# Altium project parallella_schematic.PrjPcb (part 2 of 3)

## Sheet 09-PL BANKS 34 & 35.SchDoc
size 513 x 386 mm
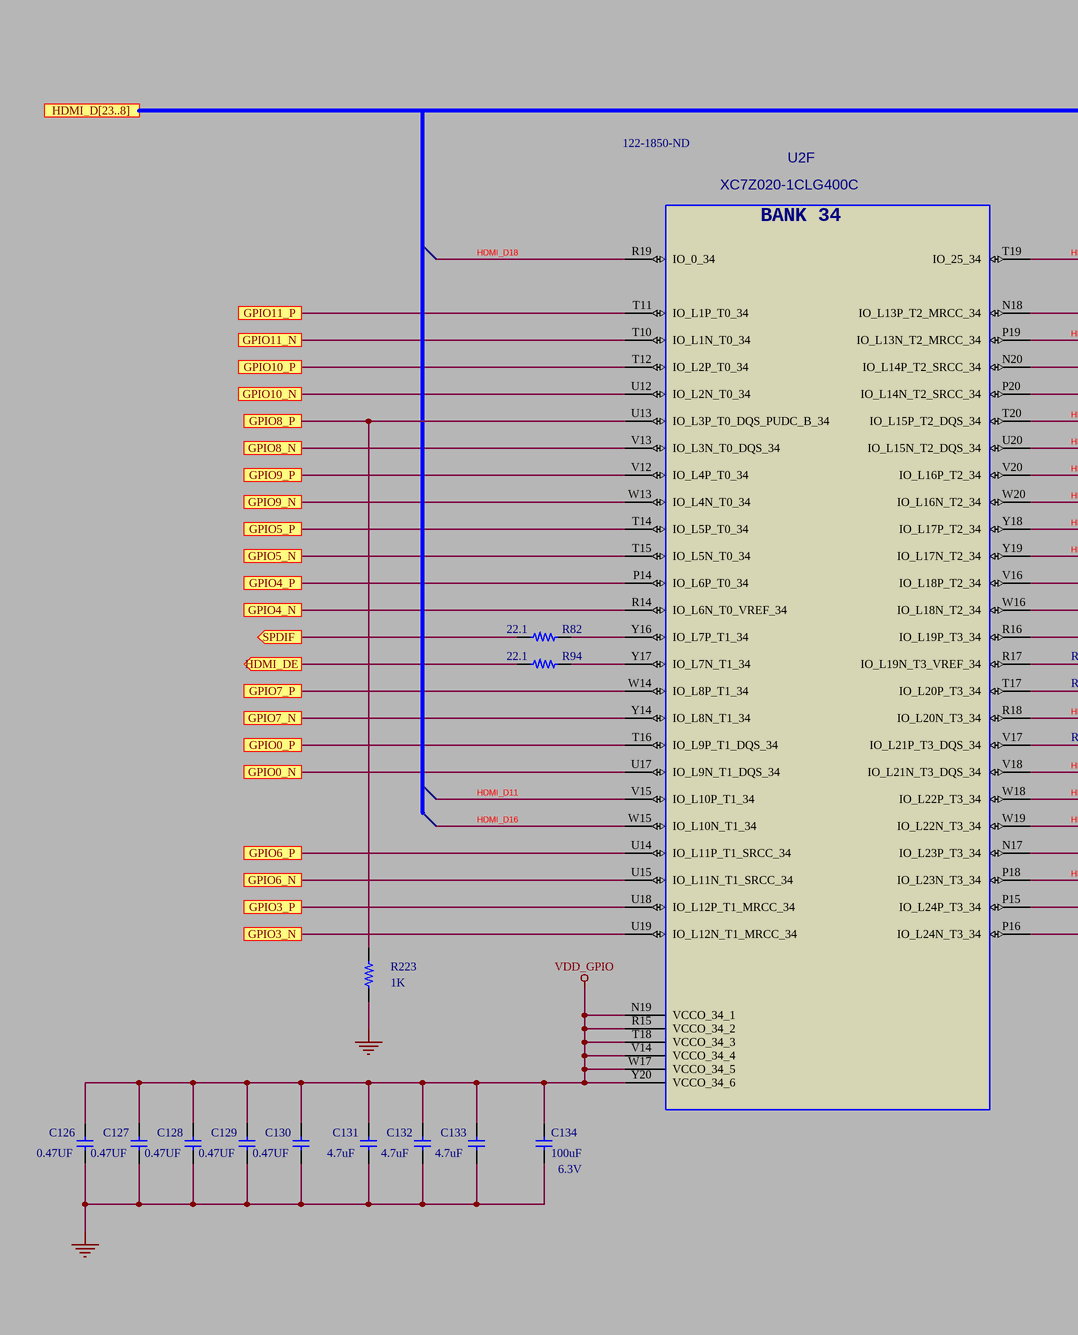
[diagram p11: 09-PL BANKS 34 & 35.SchDoc, left]
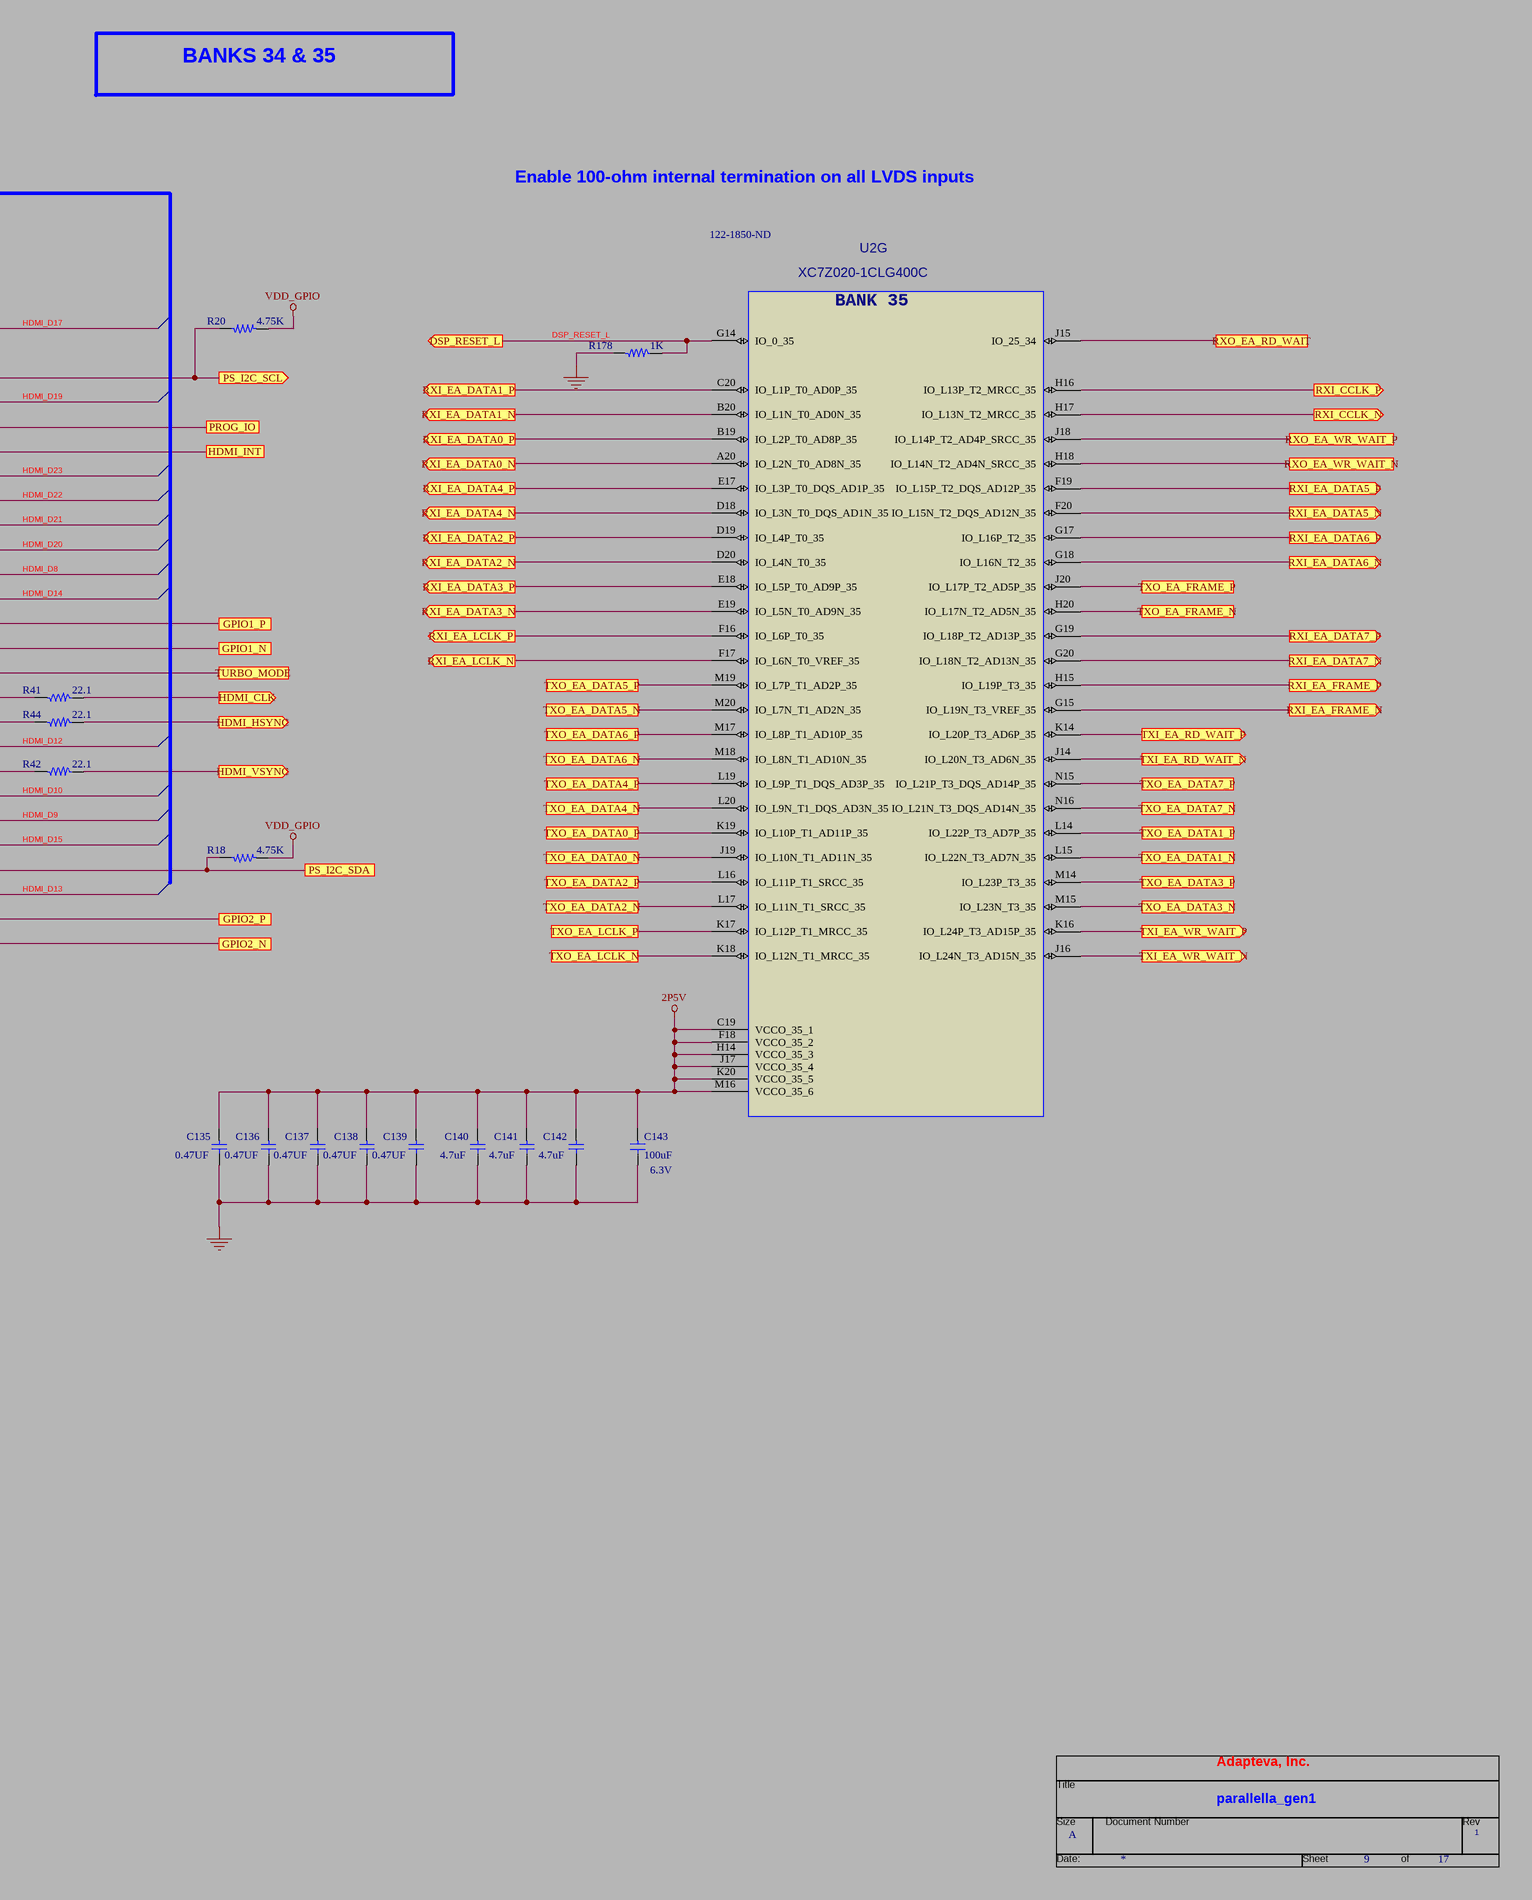
[diagram p12: 09-PL BANKS 34 & 35.SchDoc, right]

### Parts
(Parts that share a designator on the sheet are numbered #1, #2 ... from top to bottom, then left to right.)
*#9  RevCode: 1  Title: parallella_gen1  Page Size: A  Page Number: 9  Page Count: 17  OrgAddr1: Adapteva, Inc.  (hidden comment: TitleBlock0)  (graphical)
C126  0.47UF  [C0402]
C127  0.47UF  [C0402]
C128  0.47UF  [C0402]
C129  0.47UF  [C0402]
C130  0.47UF  [C0402]
C131  4.7uF  [C0402]
C132  4.7uF  [C0402]
C133  4.7uF  [C0402]
C134  100uF  VOLTAGE: 6.3V  [C1210]
C135  0.47UF  [C0402]
C136  0.47UF  [C0402]
C137  0.47UF  [C0402]
C138  0.47UF  [C0402]
C139  0.47UF  [C0402]
C140  4.7uF  [C0402]
C141  4.7uF  [C0402]
C142  4.7uF  [C0402]
C143  100uF  VOLTAGE: 6.3V  [C1210]
R18  4.75K  [R0402]
R20  4.75K  [R0402]
R41  22.1  [R0402]
R42  22.1  [R0402]
R44  22.1  [R0402]
R82  22.1  [R0402]
R94  22.1  [R0402]
R178  1K  [R0402]
R223  1K  [R0402]
U2  Vendor PN: XC7Z020-1CLG400C  Supplier Part Number 1: 122-1850-ND  [CBGA400_17SQ_1P6H_P8MMP]  (hidden comment: 7Z020-CLG400)  (parts F,G of 8)

### Ports
DSP_RESET_L (out), GPIO0_N, GPIO0_P, GPIO1_N, GPIO1_P, GPIO2_N, GPIO2_P, GPIO3_N, GPIO3_P, GPIO4_N, GPIO4_P, GPIO5_N, GPIO5_P, GPIO6_N, GPIO6_P, GPIO7_N, GPIO7_P, GPIO8_N, GPIO8_P, GPIO9_N, GPIO9_P, GPIO10_N, GPIO10_P, GPIO11_N, GPIO11_P, HDMI_CLK (out), HDMI_D[23..8], HDMI_DE (out), HDMI_HSYNC (out), HDMI_INT, HDMI_VSYNC (out), PROG_IO, PS_I2C_SCL (out), PS_I2C_SDA, RXI_CCLK_N (out), RXI_CCLK_P (out), RXI_EA_DATA0_N (out), RXI_EA_DATA0_P (out), RXI_EA_DATA1_N (out), RXI_EA_DATA1_P (out), RXI_EA_DATA2_N (out), RXI_EA_DATA2_P (out), RXI_EA_DATA3_N (out), RXI_EA_DATA3_P (out), RXI_EA_DATA4_N (out), RXI_EA_DATA4_P (out), RXI_EA_DATA5_N (out), RXI_EA_DATA5_P (out), RXI_EA_DATA6_N (out), RXI_EA_DATA6_P (out), RXI_EA_DATA7_N (out), RXI_EA_DATA7_P (out), RXI_EA_FRAME_N (out), RXI_EA_FRAME_P (out), RXI_EA_LCLK_N (out), RXI_EA_LCLK_P (out), RXO_EA_RD_WAIT, RXO_EA_WR_WAIT_N, RXO_EA_WR_WAIT_P, SPDIF (out), TURBO_MODE, TXI_EA_RD_WAIT_N (out), TXI_EA_RD_WAIT_P (out), TXI_EA_WR_WAIT_N (out), TXI_EA_WR_WAIT_P (out), TXO_EA_DATA0_N, TXO_EA_DATA0_P, TXO_EA_DATA1_N, TXO_EA_DATA1_P, TXO_EA_DATA2_N, TXO_EA_DATA2_P, TXO_EA_DATA3_N, TXO_EA_DATA3_P, TXO_EA_DATA4_N, TXO_EA_DATA4_P, TXO_EA_DATA5_N, TXO_EA_DATA5_P, TXO_EA_DATA6_N, TXO_EA_DATA6_P, TXO_EA_DATA7_N, TXO_EA_DATA7_P, TXO_EA_FRAME_N, TXO_EA_FRAME_P, TXO_EA_LCLK_N, TXO_EA_LCLK_P

### Nets
2P5V: C135.1 C136.1 C137.1 C138.1 C139.1 C140.1 C141.1 C142.1 C143.1 U2.C19(VCCO_35_1) U2.F18(VCCO_35_2) U2.H14(VCCO_35_3) U2.J17(VCCO_35_4) U2.K20(VCCO_35_5) U2.M16(VCCO_35_6)
GND: C126.2 C127.2 C128.2 C129.2 C130.2 C131.2 C132.2 C133.2 C134.2 C135.2 C136.2 C137.2 C138.2 C139.2 C140.2 C141.2 C142.2 C143.2 R178.1 R223.1  [project net PHY_DIS_REG10]
VDD_GPIO: C126.1 C127.1 C128.1 C129.1 C130.1 C131.1 C132.1 C133.1 C134.1 R18.1 R20.1 U2.N19(VCCO_34_1) U2.R15(VCCO_34_2) U2.T18(VCCO_34_3) U2.V14(VCCO_34_4) U2.W17(VCCO_34_5) U2.Y20(VCCO_34_6)
DSP_RESET_L: R178.2 U2.G14(IO_0_35) ; port DSP_RESET_L
HDMI_D8: U2.Y18(IO_L17P_T2_34)
HDMI_D9: U2.W18(IO_L22P_T3_34)
HDMI_D10: U2.V18(IO_L21N_T3_DQS_34)
HDMI_D11: U2.V15(IO_L10P_T1_34)
HDMI_D12: U2.R18(IO_L20N_T3_34)
HDMI_D13: U2.P18(IO_L23N_T3_34)
HDMI_D14: U2.Y19(IO_L17N_T2_34)
HDMI_D15: U2.W19(IO_L22N_T3_34)
HDMI_D16: U2.W15(IO_L10N_T1_34)
HDMI_D17: U2.T19(IO_25_34)
HDMI_D18: U2.R19(IO_0_34)
HDMI_D19: U2.P19(IO_L13N_T2_MRCC_34)
HDMI_D20: U2.W20(IO_L16N_T2_34)
HDMI_D21: U2.V20(IO_L16P_T2_34)
HDMI_D22: U2.U20(IO_L15N_T2_DQS_34)
HDMI_D23: U2.T20(IO_L15P_T2_DQS_34)
NetJ11_3: U2.U17(IO_L9N_T1_DQS_34) ; port GPIO0_N
NetJ11_4: U2.W16(IO_L18N_T2_34) ; port GPIO1_N
NetJ11_5: U2.T16(IO_L9P_T1_DQS_34) ; port GPIO0_P
NetJ11_6: U2.V16(IO_L18P_T2_34) ; port GPIO1_P
NetJ11_7: U2.P16(IO_L24N_T3_34) ; port GPIO2_N
NetJ11_8: U2.U19(IO_L12N_T1_MRCC_34) ; port GPIO3_N
NetJ11_9: U2.P15(IO_L24P_T3_34) ; port GPIO2_P
NetJ11_10: U2.U18(IO_L12P_T1_MRCC_34) ; port GPIO3_P
NetJ11_13: U2.R14(IO_L6N_T0_VREF_34) ; port GPIO4_N
NetJ11_14: U2.T15(IO_L5N_T0_34) ; port GPIO5_N
NetJ11_15: U2.P14(IO_L6P_T0_34) ; port GPIO4_P
NetJ11_16: U2.T14(IO_L5P_T0_34) ; port GPIO5_P
NetJ11_17: U2.U15(IO_L11N_T1_SRCC_34) ; port GPIO6_N
NetJ11_18: U2.Y14(IO_L8N_T1_34) ; port GPIO7_N
NetJ11_19: U2.U14(IO_L11P_T1_SRCC_34) ; port GPIO6_P
NetJ11_20: U2.W14(IO_L8P_T1_34) ; port GPIO7_P
NetJ11_23: U2.V13(IO_L3N_T0_DQS_34) ; port GPIO8_N
NetJ11_24: U2.W13(IO_L4N_T0_34) ; port GPIO9_N
NetJ11_25: R223.2 U2.U13(IO_L3P_T0_DQS_PUDC_B_34) ; port GPIO8_P
NetJ11_26: U2.V12(IO_L4P_T0_34) ; port GPIO9_P
NetJ11_27: U2.U12(IO_L2N_T0_34) ; port GPIO10_N
NetJ11_28: U2.T10(IO_L1N_T0_34) ; port GPIO11_N
NetJ11_29: U2.T12(IO_L2P_T0_34) ; port GPIO10_P
NetJ11_30: U2.T11(IO_L1P_T0_34) ; port GPIO11_P
NetJ13_9: U2.N20(IO_L14P_T2_SRCC_34) ; port PROG_IO
NetJ13_25: U2.R16(IO_L19P_T3_34) ; port TURBO_MODE
NetJ13_27: R82.2 ; port SPDIF
NetR18_2: R18.2 U2.N17(IO_L23P_T3_34) ; port PS_I2C_SDA
NetR20_2: R20.2 U2.N18(IO_L13P_T2_MRCC_34) ; port PS_I2C_SCL
NetR22_1: U2.P20(IO_L14N_T2_SRCC_34) ; port HDMI_INT
NetR41_1: R41.1 U2.R17(IO_L19N_T3_VREF_34)
NetR41_2: R41.2 ; port HDMI_CLK
NetR42_1: R42.1 U2.V17(IO_L21P_T3_DQS_34)
NetR42_2: R42.2 ; port HDMI_VSYNC
NetR44_1: R44.1 U2.T17(IO_L20P_T3_34)
NetR44_2: R44.2 ; port HDMI_HSYNC
NetR82_1: R82.1 U2.Y16(IO_L7P_T1_34)
NetR94_1: R94.1 U2.Y17(IO_L7N_T1_34)
NetR94_2: R94.2 ; port HDMI_DE
NetR180_1: U2.B19(IO_L2P_T0_AD8P_35) ; port RXI_EA_DATA0_P
NetR180_2: U2.A20(IO_L2N_T0_AD8N_35) ; port RXI_EA_DATA0_N
NetR181_1: U2.C20(IO_L1P_T0_AD0P_35) ; port RXI_EA_DATA1_P
NetR181_2: U2.B20(IO_L1N_T0_AD0N_35) ; port RXI_EA_DATA1_N
NetR182_1: U2.D19(IO_L4P_T0_35) ; port RXI_EA_DATA2_P
NetR182_2: U2.D20(IO_L4N_T0_35) ; port RXI_EA_DATA2_N
NetR183_1: U2.E18(IO_L5P_T0_AD9P_35) ; port RXI_EA_DATA3_P
NetR183_2: U2.E19(IO_L5N_T0_AD9N_35) ; port RXI_EA_DATA3_N
NetR184_1: U2.E17(IO_L3P_T0_DQS_AD1P_35) ; port RXI_EA_DATA4_P
NetR184_2: U2.D18(IO_L3N_T0_DQS_AD1N_35) ; port RXI_EA_DATA4_N
NetR185_1: U2.F19(IO_L15P_T2_DQS_AD12P_35) ; port RXI_EA_DATA5_P
NetR185_2: U2.F20(IO_L15N_T2_DQS_AD12N_35) ; port RXI_EA_DATA5_N
NetR186_1: U2.G17(IO_L16P_T2_35) ; port RXI_EA_DATA6_P
NetR186_2: U2.G18(IO_L16N_T2_35) ; port RXI_EA_DATA6_N
NetR187_1: U2.G19(IO_L18P_T2_AD13P_35) ; port RXI_EA_DATA7_P
NetR187_2: U2.G20(IO_L18N_T2_AD13N_35) ; port RXI_EA_DATA7_N
NetR188_1: U2.H15(IO_L19P_T3_35) ; port RXI_EA_FRAME_P
NetR188_2: U2.G15(IO_L19N_T3_VREF_35) ; port RXI_EA_FRAME_N
NetR189_1: U2.F16(IO_L6P_T0_35) ; port RXI_EA_LCLK_P
NetR189_2: U2.F17(IO_L6N_T0_VREF_35) ; port RXI_EA_LCLK_N
NetR190_1: U2.K14(IO_L20P_T3_AD6P_35) ; port TXI_EA_RD_WAIT_P
NetR190_2: U2.J14(IO_L20N_T3_AD6N_35) ; port TXI_EA_RD_WAIT_N
NetR191_1: U2.K16(IO_L24P_T3_AD15P_35) ; port TXI_EA_WR_WAIT_P
NetR191_2: U2.J16(IO_L24N_T3_AD15N_35) ; port TXI_EA_WR_WAIT_N
NetR192_1: U2.H16(IO_L13P_T2_MRCC_35) ; port RXI_CCLK_P
NetR192_2: U2.H17(IO_L13N_T2_MRCC_35) ; port RXI_CCLK_N
NetU2_H18: U2.H18(IO_L14N_T2_AD4N_SRCC_35) ; port RXO_EA_WR_WAIT_N
NetU2_H20: U2.H20(IO_L17N_T2_AD5N_35) ; port TXO_EA_FRAME_N
NetU2_J15: U2.J15(IO_25_34) ; port RXO_EA_RD_WAIT
NetU2_J18: U2.J18(IO_L14P_T2_AD4P_SRCC_35) ; port RXO_EA_WR_WAIT_P
NetU2_J19: U2.J19(IO_L10N_T1_AD11N_35) ; port TXO_EA_DATA0_N
NetU2_J20: U2.J20(IO_L17P_T2_AD5P_35) ; port TXO_EA_FRAME_P
NetU2_K17: U2.K17(IO_L12P_T1_MRCC_35) ; port TXO_EA_LCLK_P
NetU2_K18: U2.K18(IO_L12N_T1_MRCC_35) ; port TXO_EA_LCLK_N
NetU2_K19: U2.K19(IO_L10P_T1_AD11P_35) ; port TXO_EA_DATA0_P
NetU2_L14: U2.L14(IO_L22P_T3_AD7P_35) ; port TXO_EA_DATA1_P
NetU2_L15: U2.L15(IO_L22N_T3_AD7N_35) ; port TXO_EA_DATA1_N
NetU2_L16: U2.L16(IO_L11P_T1_SRCC_35) ; port TXO_EA_DATA2_P
NetU2_L17: U2.L17(IO_L11N_T1_SRCC_35) ; port TXO_EA_DATA2_N
NetU2_L19: U2.L19(IO_L9P_T1_DQS_AD3P_35) ; port TXO_EA_DATA4_P
NetU2_L20: U2.L20(IO_L9N_T1_DQS_AD3N_35) ; port TXO_EA_DATA4_N
NetU2_M14: U2.M14(IO_L23P_T3_35) ; port TXO_EA_DATA3_P
NetU2_M15: U2.M15(IO_L23N_T3_35) ; port TXO_EA_DATA3_N
NetU2_M17: U2.M17(IO_L8P_T1_AD10P_35) ; port TXO_EA_DATA6_P
NetU2_M18: U2.M18(IO_L8N_T1_AD10N_35) ; port TXO_EA_DATA6_N
NetU2_M19: U2.M19(IO_L7P_T1_AD2P_35) ; port TXO_EA_DATA5_P
NetU2_M20: U2.M20(IO_L7N_T1_AD2N_35) ; port TXO_EA_DATA5_N
NetU2_N15: U2.N15(IO_L21P_T3_DQS_AD14P_35) ; port TXO_EA_DATA7_P
NetU2_N16: U2.N16(IO_L21N_T3_DQS_AD14N_35) ; port TXO_EA_DATA7_N

### Notes on the sheet
- BANKS 34 & 35
- Enable 100-ohm internal termination on all LVDS inputs
- (in symbol TitleBlock0) Title; Size; Document Number; Rev; Date:; Sheet; of
- (in symbol ZYNQ_7Z020_CLG400, part F) BANK 34
- (in symbol ZYNQ_7Z020_CLG400, part G) BANK 35

### Library data of the parts
C126-C130 C135-C139 = CAP0402_0P47UF_X5R: as C14 on sheet 03-ZYNQ BANK 500; DEVICE: CAP0402_0P47UF_X5R; Vendor: TDK; Vendor PN: C1005X5R1C474K; PCB Footprint: C0402
C131-C133 C140-C142 = CAP0402_4P7UF_X5R: as C13 on sheet 03-ZYNQ BANK 500; DEVICE: CAP0402_4P7UF_X5R; Vendor: TDK; Vendor PN: C1005X5R0J475K; PCB Footprint: C0402
C134 C143 = CAP1210_100UF_X5R_LOESR: as C286 on sheet 02-ZYNQ BANK 0; DEVICE: CAP1210_100UF_X5R_LOESR; Vendor: MURATA; Vendor PN: GRM32ER60J107ME20L; PCB Footprint: C1210
R18 R20 = RES0402_4K75: as R4 on sheet 02-ZYNQ BANK 0; DEVICE: RES0402_4K75; Vendor PN: CRCW04024K75FKED; PCB Footprint: R0402
R41 R42 R44 R82 R94 = RES0402_22R1: RES, 0402, 22.1, 1%; MFG PART NO: CRCW040222R1FKED; MFG: VISHAY; Vendor: VISHAY/DALE; ALT_SYMBOLS: R0402_BGA; DEVICE: RES0402_22R1; Vendor PN: CRCW040222R1FKED; PCB Footprint: R0402
R178 R223 = RES0402_1K: as R11 on sheet 02-ZYNQ BANK 0; DEVICE: RES0402_1K; Vendor PN: CRCW04021K00FKED; PCB Footprint: R0402
U2 = ZYNQ_7Z020_CLG400: as U2 on sheet 02-ZYNQ BANK 0; Vendor: XILINX; DEVICE: ZYNQ_7Z020_CLG400; PCB Footprint: CBGA400_17SQ_1P6H_P8MMP; Supplier 1: Digi-Key
*#9 = TitleBlock0: Page Create Date: March  8, 1995; Page Modify Date: *

## Sheet 10-ZYNQ PWR & GND.SchDoc
size 513 x 386 mm
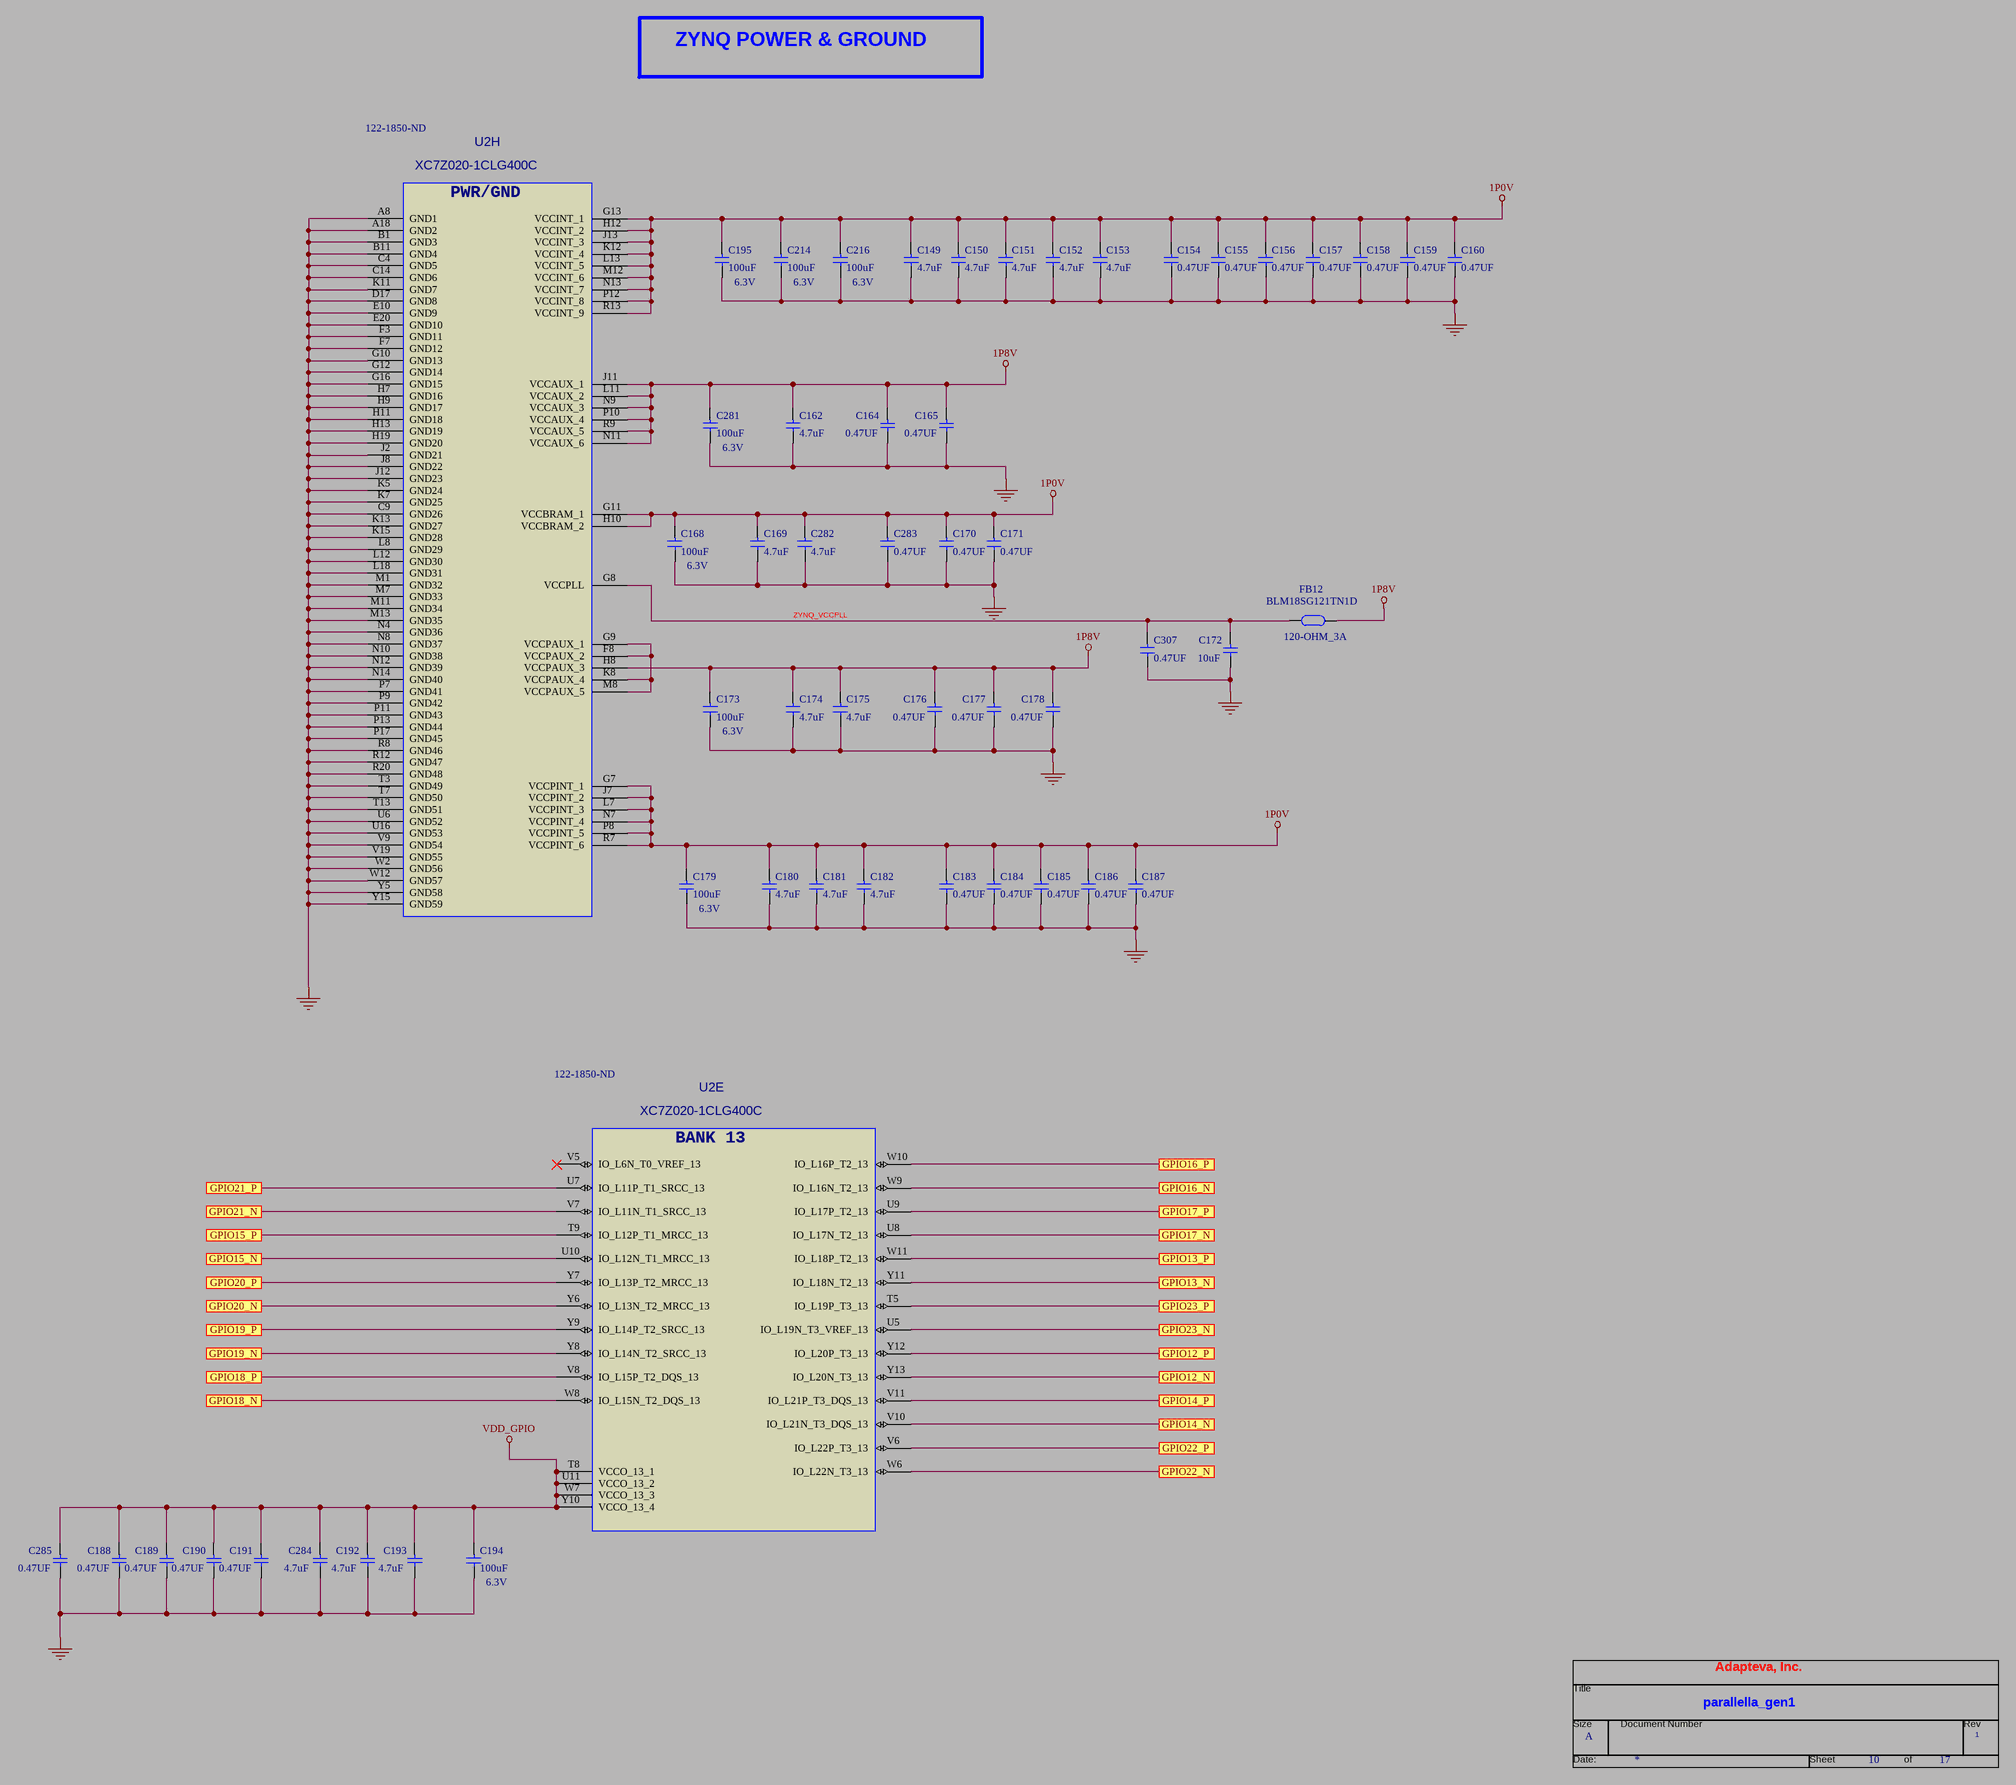
[diagram p13: 10-ZYNQ PWR & GND.SchDoc]

### Parts
(Parts that share a designator on the sheet are numbered #1, #2 ... from top to bottom, then left to right.)
*#10  RevCode: 1  Title: parallella_gen1  Page Size: A  Page Number: 10  Page Count: 17  OrgAddr1: Adapteva, Inc.  (hidden comment: TitleBlock0)  (graphical)
C149  4.7uF  [C0402]
C150  4.7uF  [C0402]
C151  4.7uF  [C0402]
C152  4.7uF  [C0402]
C153  4.7uF  [C0402]
C154  0.47UF  [C0402]
C155  0.47UF  [C0402]
C156  0.47UF  [C0402]
C157  0.47UF  [C0402]
C158  0.47UF  [C0402]
C159  0.47UF  [C0402]
C160  0.47UF  [C0402]
C162  4.7uF  [C0402]
C164  0.47UF  [C0402]
C165  0.47UF  [C0402]
C168  100uF  VOLTAGE: 6.3V  [C1210]
C169  4.7uF  [C0402]
C170  0.47UF  [C0402]
C171  0.47UF  [C0402]
C172  10uF  [C0603]
C173  100uF  VOLTAGE: 6.3V  [C1210]
C174  4.7uF  [C0402]
C175  4.7uF  [C0402]
C176  0.47UF  [C0402]
C177  0.47UF  [C0402]
C178  0.47UF  [C0402]
C179  100uF  VOLTAGE: 6.3V  [C1210]
C180  4.7uF  [C0402]
C181  4.7uF  [C0402]
C182  4.7uF  [C0402]
C183  0.47UF  [C0402]
C184  0.47UF  [C0402]
C185  0.47UF  [C0402]
C186  0.47UF  [C0402]
C187  0.47UF  [C0402]
C188  0.47UF  [C0402]
C189  0.47UF  [C0402]
C190  0.47UF  [C0402]
C191  0.47UF  [C0402]
C192  4.7uF  [C0402]
C193  4.7uF  [C0402]
C194  100uF  VOLTAGE: 6.3V  [C1210]
C195  100uF  VOLTAGE: 6.3V  [C1210]
C214  100uF  VOLTAGE: 6.3V  [C1210]
C216  100uF  VOLTAGE: 6.3V  [C1210]
C281  100uF  VOLTAGE: 6.3V  [C1210]
C282  4.7uF  [C0402]
C283  0.47UF  [C0402]
C284  4.7uF  [C0402]
C285  0.47UF  [C0402]
C307  0.47UF  [C0402]
FB12  120-OHM_3A  [BEAD_0603]
U2  Vendor PN: XC7Z020-1CLG400C  Supplier Part Number 1: 122-1850-ND  [CBGA400_17SQ_1P6H_P8MMP]  (hidden comment: 7Z020-CLG400)  (parts E,H of 8)

### Ports
GPIO12_N, GPIO12_P, GPIO13_N, GPIO13_P, GPIO14_N, GPIO14_P, GPIO15_N, GPIO15_P, GPIO16_N, GPIO16_P, GPIO17_N, GPIO17_P, GPIO18_N, GPIO18_P, GPIO19_N, GPIO19_P, GPIO20_N, GPIO20_P, GPIO21_N, GPIO21_P, GPIO22_N, GPIO22_P, GPIO23_N, GPIO23_P

### Nets
1P0V: C149.1 C150.1 C151.1 C152.1 C153.1 C154.1 C155.1 C156.1 C157.1 C158.1 C159.1 C160.1 C168.1 C169.1 C170.1 C171.1 C179.1 C180.1 C181.1 C182.1 C183.1 C184.1 C185.1 C186.1 C187.1 C195.1 C214.1 C216.1 C282.1 C283.1 U2.G7(VCCPINT_1) U2.G11(VCCBRAM_1) U2.G13(VCCINT_1) U2.H10(VCCBRAM_2) U2.H12(VCCINT_2) U2.J7(VCCPINT_2) U2.J13(VCCINT_3) U2.K12(VCCINT_4) U2.L7(VCCPINT_3) U2.L13(VCCINT_5) U2.M12(VCCINT_6) U2.N7(VCCPINT_4) U2.N13(VCCINT_7) U2.P8(VCCPINT_5) U2.P12(VCCINT_8) U2.R7(VCCPINT_6) U2.R13(VCCINT_9)
1P8V: C162.1 C164.1 C165.1 C173.1 C174.1 C175.1 C176.1 C177.1 C178.1 C281.1 FB12.1 U2.H8(VCCPAUX_3) U2.J11(VCCAUX_1) U2.L11(VCCAUX_2) U2.N9(VCCAUX_3) U2.N11(VCCAUX_6) U2.P10(VCCAUX_4) U2.R9(VCCAUX_5)
GND: C149.2 C150.2 C151.2 C152.2 C153.2 C154.2 C155.2 C156.2 C157.2 C158.2 C159.2 C160.2 C162.2 C164.2 C165.2 C168.2 C169.2 C170.2 C171.2 C172.2 C173.2 C174.2 C175.2 C176.2 C177.2 C178.2 C179.2 C180.2 C181.2 C182.2 C183.2 C184.2 C185.2 C186.2 C187.2 C188.2 C189.2 C190.2 C191.2 C192.2 C193.2 C194.2 C195.2 C214.2 C216.2 C281.2 C282.2 C283.2 C284.2 C285.2 C307.2 U2.A8(GND1) U2.A18(GND2) U2.B1(GND3) U2.B11(GND4) U2.C4(GND5) U2.C9(GND26) U2.C14(GND6) U2.D17(GND8) U2.E10(GND9) U2.E20(GND10) U2.F3(GND11) U2.F7(GND12) U2.G10(GND13) U2.G12(GND14) U2.G16(GND15) U2.H7(GND16) U2.H9(GND17) U2.H11(GND18) U2.H13(GND19) U2.H19(GND20) U2.J2(GND21) U2.J8(GND22) U2.J12(GND23) U2.K5(GND24) U2.K7(GND25) U2.K11(GND7) U2.K13(GND27) U2.K15(GND28) U2.L8(GND29) U2.L12(GND30) U2.L18(GND31) U2.M1(GND32) U2.M7(GND33) U2.M11(GND34) U2.M13(GND35) U2.N4(GND36) U2.N8(GND37) U2.N10(GND38) U2.N12(GND39) U2.N14(GND40) U2.P7(GND41) U2.P9(GND42) U2.P11(GND43) U2.P13(GND44) U2.P17(GND45) U2.R8(GND46) U2.R12(GND47) U2.R20(GND48) U2.T3(GND49) U2.T7(GND50) U2.T13(GND51) U2.U6(GND52) U2.U16(GND53) U2.V9(GND54) U2.V19(GND55) U2.W2(GND56) U2.W12(GND57) U2.Y5(GND58) U2.Y15(GND59)  [project net PHY_DIS_REG10]
VDD_GPIO: C188.1 C189.1 C190.1 C191.1 C192.1 C193.1 C194.1 C284.1 C285.1 U2.T8(VCCO_13_1) U2.U11(VCCO_13_2) U2.W7(VCCO_13_3) U2.Y10(VCCO_13_4)
ZYNQ_VCCPLL: C172.1 C307.1 FB12.2 U2.G8(VCCPLL)
NetJ11_33: U2.Y13(IO_L20N_T3_13) ; port GPIO12_N
NetJ11_34: U2.Y11(IO_L18N_T2_13) ; port GPIO13_N
NetJ11_35: U2.Y12(IO_L20P_T3_13) ; port GPIO12_P
NetJ11_36: U2.W11(IO_L18P_T2_13) ; port GPIO13_P
NetJ11_37: U2.V10(IO_L21N_T3_DQS_13) ; port GPIO14_N
NetJ11_38: U2.U10(IO_L12N_T1_MRCC_13) ; port GPIO15_N
NetJ11_39: U2.V11(IO_L21P_T3_DQS_13) ; port GPIO14_P
NetJ11_40: U2.T9(IO_L12P_T1_MRCC_13) ; port GPIO15_P
NetJ11_43: U2.W9(IO_L16N_T2_13) ; port GPIO16_N
NetJ11_44: U2.U8(IO_L17N_T2_13) ; port GPIO17_N
NetJ11_45: U2.W10(IO_L16P_T2_13) ; port GPIO16_P
NetJ11_46: U2.U9(IO_L17P_T2_13) ; port GPIO17_P
NetJ11_47: U2.W8(IO_L15N_T2_DQS_13) ; port GPIO18_N
NetJ11_48: U2.Y8(IO_L14N_T2_SRCC_13) ; port GPIO19_N
NetJ11_49: U2.V8(IO_L15P_T2_DQS_13) ; port GPIO18_P
NetJ11_50: U2.Y9(IO_L14P_T2_SRCC_13) ; port GPIO19_P
NetJ11_53: U2.Y6(IO_L13N_T2_MRCC_13) ; port GPIO20_N
NetJ11_54: U2.V7(IO_L11N_T1_SRCC_13) ; port GPIO21_N
NetJ11_55: U2.Y7(IO_L13P_T2_MRCC_13) ; port GPIO20_P
NetJ11_56: U2.U7(IO_L11P_T1_SRCC_13) ; port GPIO21_P
NetJ11_57: U2.W6(IO_L22N_T3_13) ; port GPIO22_N
NetJ11_58: U2.U5(IO_L19N_T3_VREF_13) ; port GPIO23_N
NetJ11_59: U2.V6(IO_L22P_T3_13) ; port GPIO22_P
NetJ11_60: U2.T5(IO_L19P_T3_13) ; port GPIO23_P
NetU2_F8: U2.F8(VCCPAUX_2) U2.G9(VCCPAUX_1) U2.K8(VCCPAUX_4) U2.M8(VCCPAUX_5)

Not connected (* = marked no-connect by the designer): U2 V5(IO_L6N_T0_VREF_13)*

### Notes on the sheet
- ZYNQ POWER & GROUND
- (in symbol TitleBlock0) Title; Size; Document Number; Rev; Date:; Sheet; of
- (in symbol ZYNQ_7Z020_CLG400, part E) BANK 13
- (in symbol ZYNQ_7Z020_CLG400, part H) PWR/GND

### Library data of the parts
C149-C153 C162 C169 C174 C175 C180-C182 C192 C193 C282 C284 = CAP0402_4P7UF_X5R: CAP, 0402, 4.7UF, X5R, 6.3V; MFG PART NO: C1005X5R0J475K; MFG: TDK; ALT_SYMBOLS: C0402_BGA; DEVICE: CAP0402_4P7UF_X5R; Vendor: TDK; Vendor PN: C1005X5R0J475K; PCB Footprint: C0402
C154-C160 C164 C165 C170 C171 C176-C178 C183-C191 C283 C285 C307 = CAP0402_0P47UF_X5R: CAP, 0402, 0.47UF, X5R, 16V; MFG PART NO: C1005X5R1C474K; MFG: TDK; ALT_SYMBOLS: C0402_BGA; DEVICE: CAP0402_0P47UF_X5R; Vendor: TDK; Vendor PN: C1005X5R1C474K; PCB Footprint: C0402
C168 C173 C179 C194 C195 C214 C216 C281 = CAP1210_100UF_X5R_LOESR: CAP, 1210, 100UF, X5R, 6.3V, LOW ESR; MFG PART NO: GRM32ER60J107ME20L; MFG: MURATA; DEVICE: CAP1210_100UF_X5R_LOESR; Vendor: MURATA; Vendor PN: GRM32ER60J107ME20L; PCB Footprint: C1210
C172 = CAP0603_10UF_X5R: CAP, 0603, 10UF, X5R, 10V; MFG PART NO: LMK107BJ106MALTD; MFG: TAIYO YUDEN; DEVICE: CAP0603_10UF_X5R; Vendor: TAIYO YUDEN; Vendor PN: LMK107BJ106MALTD; PCB Footprint: C0603
FB12 = BLM18SG121TN1D: FERRITE, BEAD, FILTER, 0603, 3A; Vendor: MURATA; PCB Footprint: FB0603; Vendor PN: BLM18SG121TN1D; DEVICE: BLM18SG121TN1D
U2 = ZYNQ_7Z020_CLG400: IC, EPP, XILINX, ZYNQ, 7Z020, CLG400; SPLIT_INST: TRUE; Vendor: XILINX; DEVICE: ZYNQ_7Z020_CLG400; PCB Footprint: CBGA400_17SQ_1P6H_P8MMP; Supplier 1: Digi-Key
*#10 = TitleBlock0: Page Create Date: March  8, 1995; Page Modify Date: *

## Sheet 11-DSP PROCESSOR 1-OF-3.SchDoc
size 513 x 386 mm
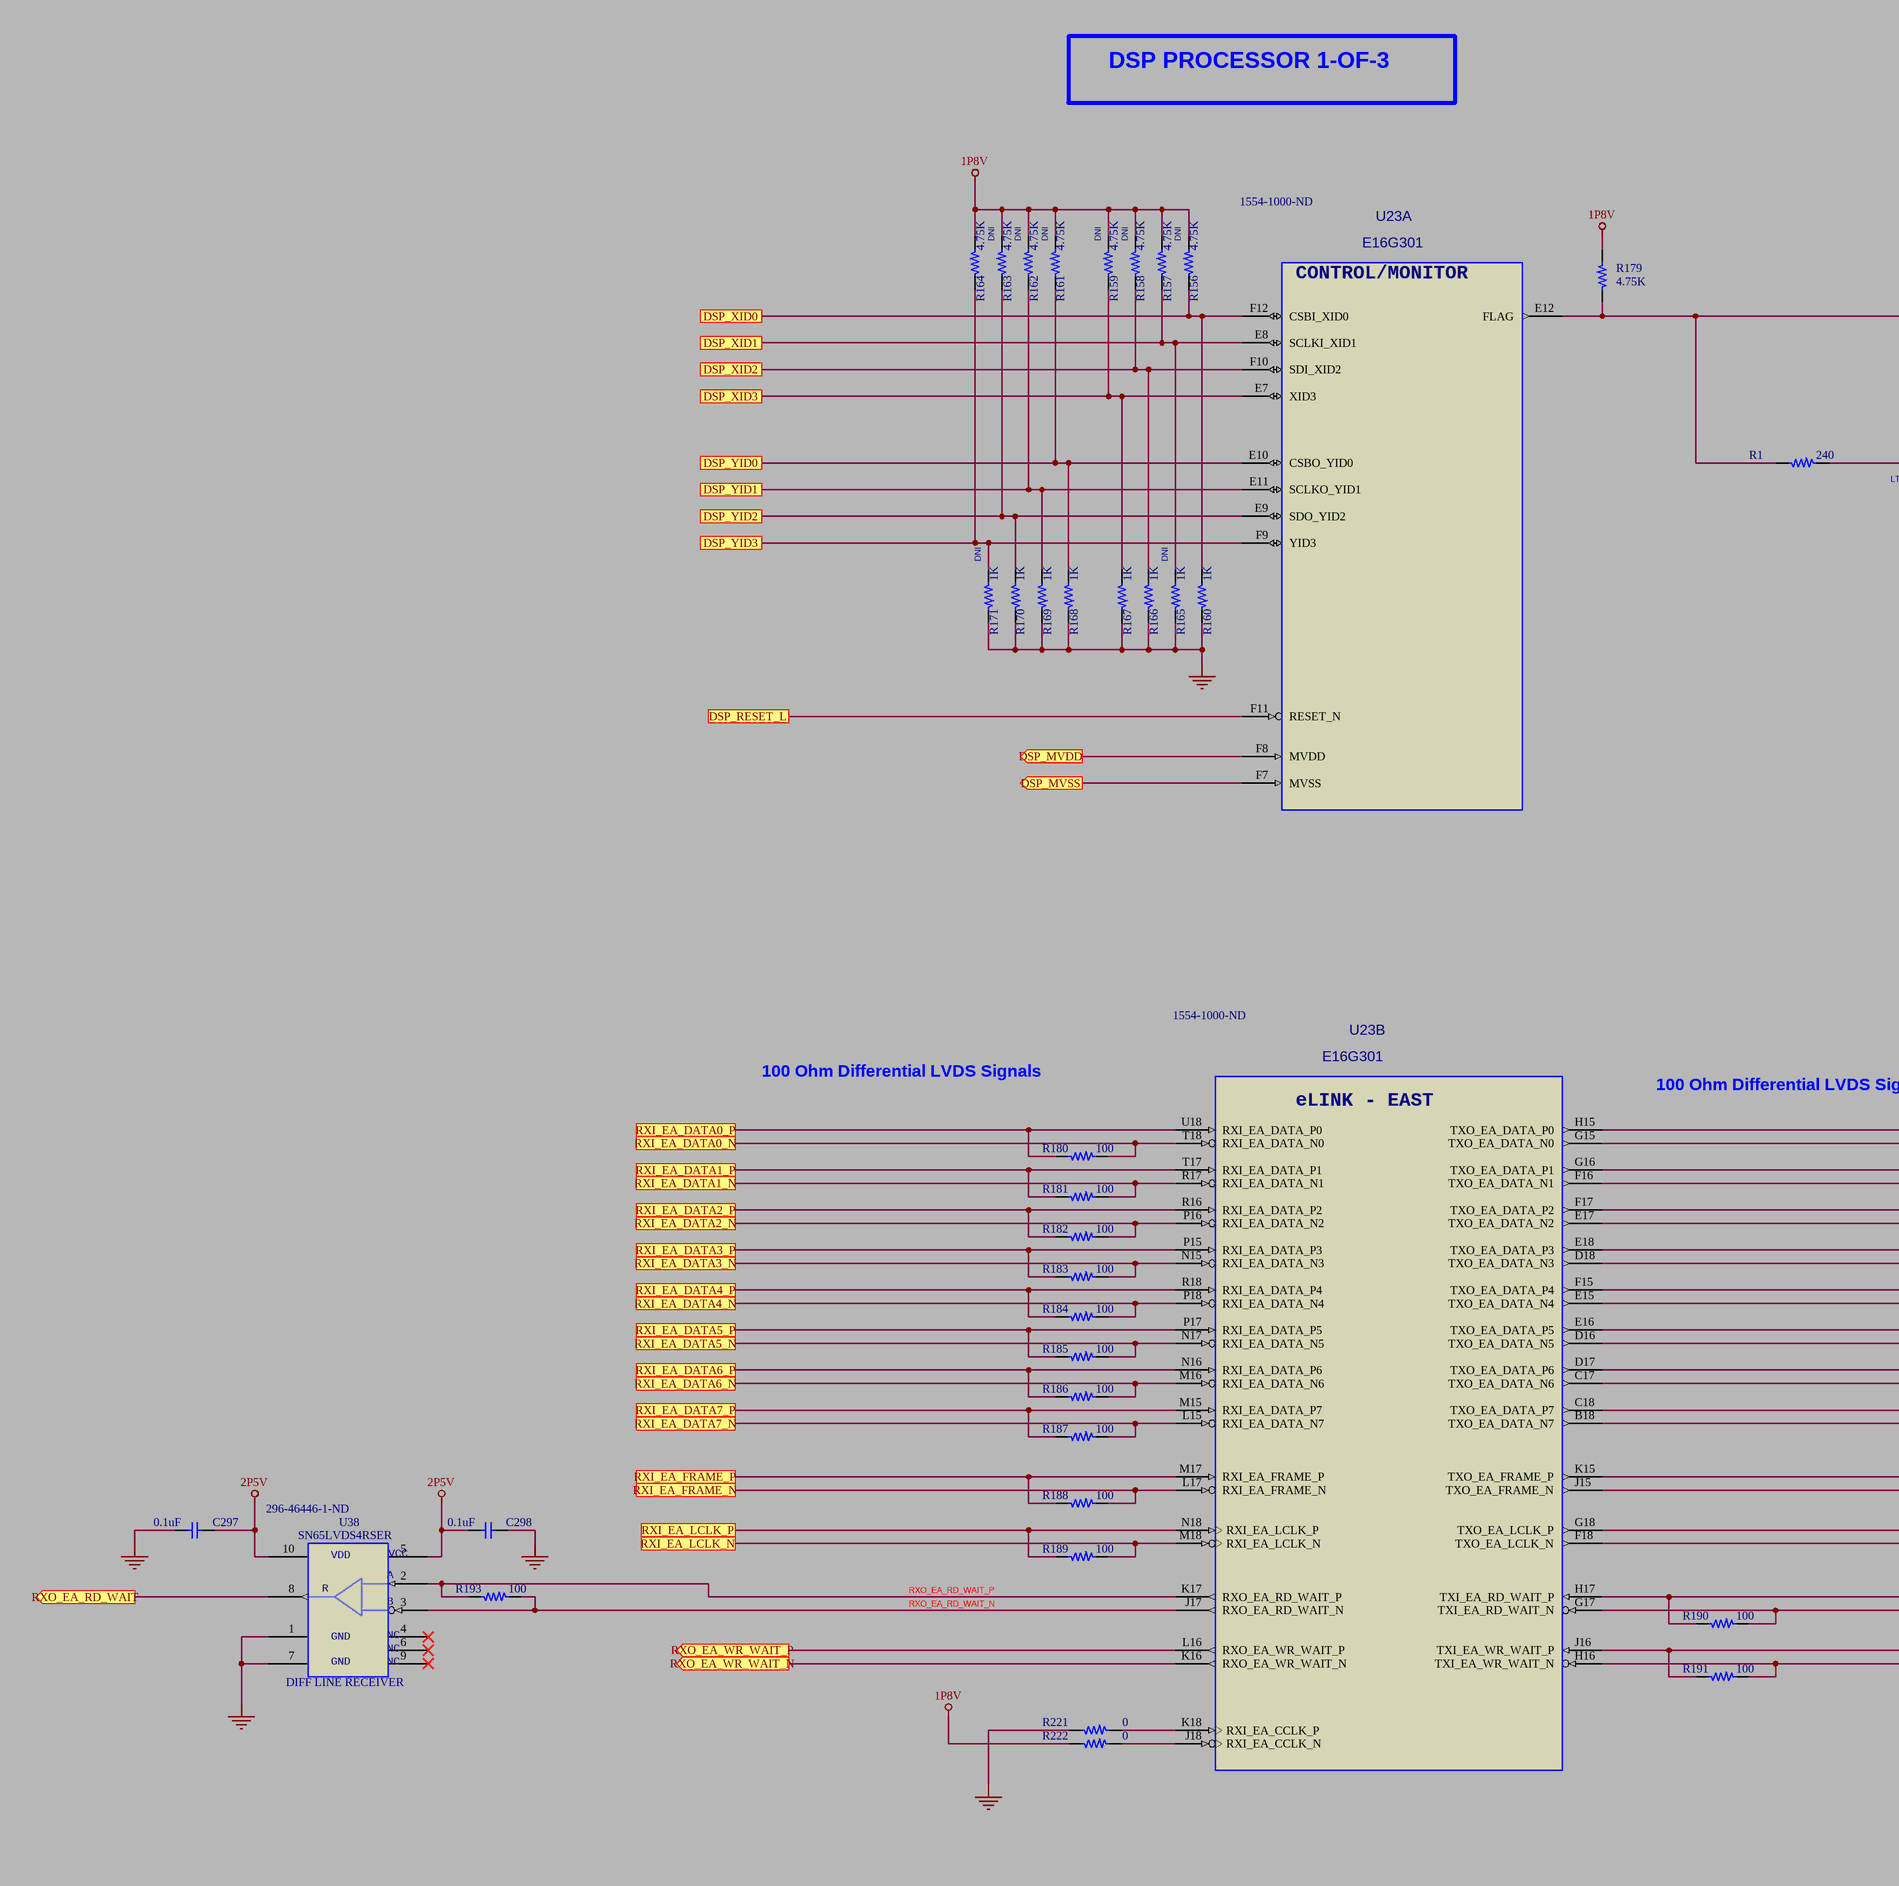
[diagram p14: 11-DSP PROCESSOR 1-OF-3.SchDoc, left]
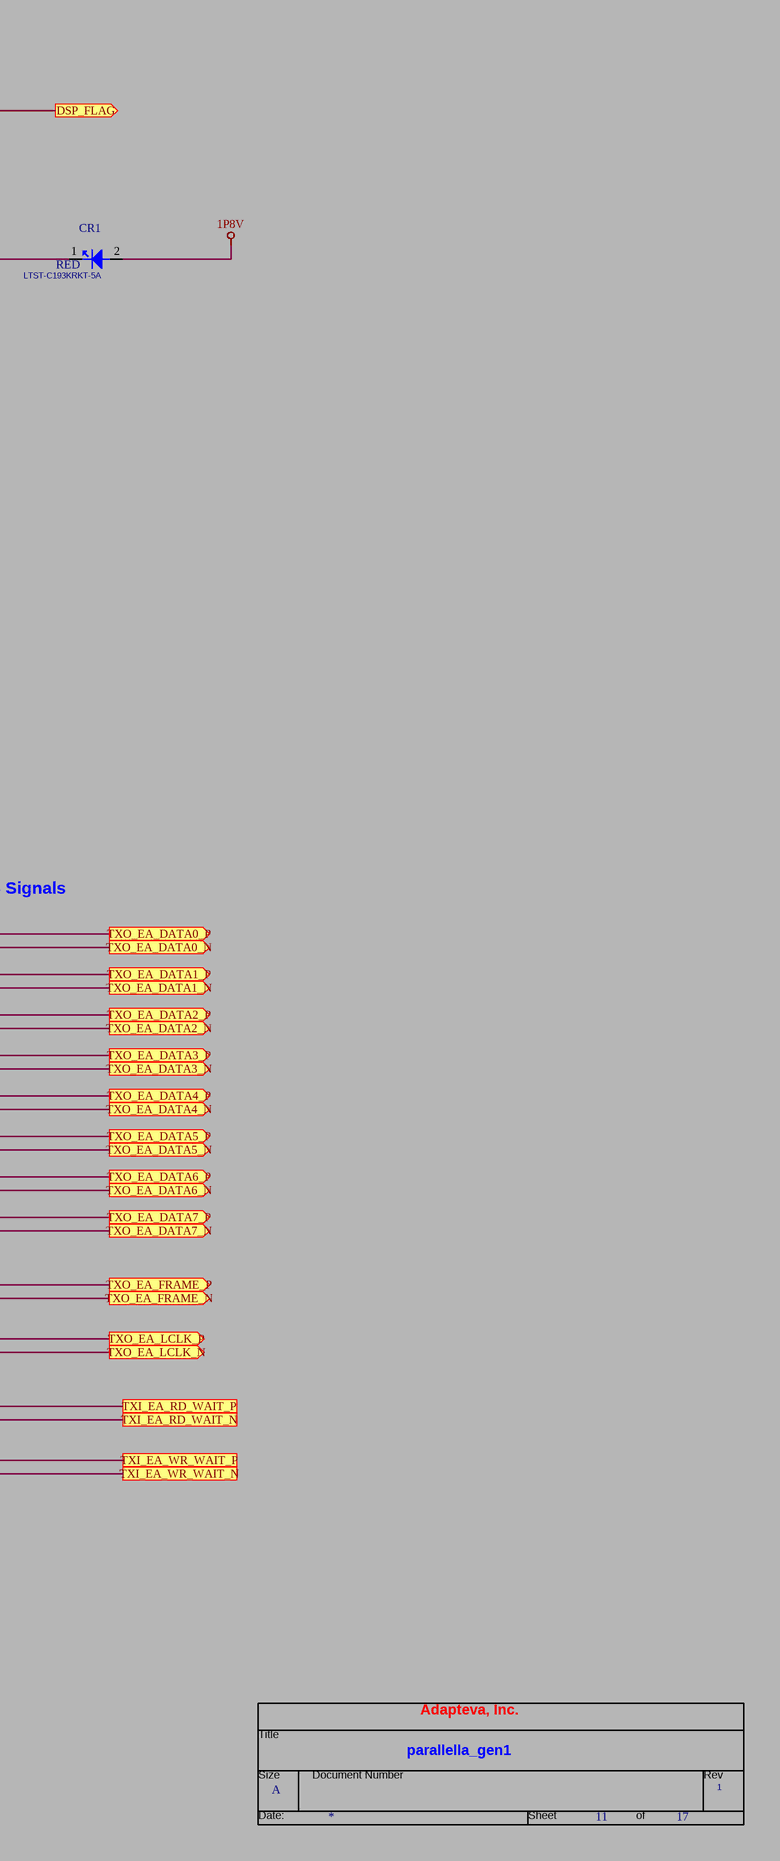
[diagram p15: 11-DSP PROCESSOR 1-OF-3.SchDoc, right]

### Parts
(Parts that share a designator on the sheet are numbered #1, #2 ... from top to bottom, then left to right.)
*#11  RevCode: 1  Title: parallella_gen1  Page Size: A  Page Number: 11  Page Count: 17  OrgAddr1: Adapteva, Inc.  (hidden comment: TitleBlock0)  (graphical)
C297  0.1uF  [C0402]
C298  0.1uF  [C0402]
CR1  RED  Vendor PN: LTST-C193KRKT-5A  [LED_0603]
R1  240  [R0402]
R156  4.75K  INSTALL: DNI  [R0402]
R157  4.75K  [R0402]
R158  4.75K  INSTALL: DNI  [R0402]
R159  4.75K  INSTALL: DNI  [R0402]
R160  1K  [R0402]
R161  4.75K  INSTALL: DNI  [R0402]
R162  4.75K  INSTALL: DNI  [R0402]
R163  4.75K  INSTALL: DNI  [R0402]
R164  4.75K  [R0402]
R165  1K  INSTALL: DNI  [R0402]
R166  1K  [R0402]
R167  1K  [R0402]
R168  1K  [R0402]
R169  1K  [R0402]
R170  1K  [R0402]
R171  1K  INSTALL: DNI  [R0402]
R179  4.75K  [R0402]
R180  100  [R0402]
R181  100  [R0402]
R182  100  [R0402]
R183  100  [R0402]
R184  100  [R0402]
R185  100  [R0402]
R186  100  [R0402]
R187  100  [R0402]
R188  100  [R0402]
R189  100  [R0402]
R190  100  [R0402]
R191  100  [R0402]
R193  100  [R0402]
R221  0  [R0402]
R222  0  [R0402]
U23  Vendor PN: E16G301  Supplier Part Number 1: 1554-1000-ND  [BGA324_15SQX1P5_P8MMP]  (hidden comment: 16-CORE MICROPROCESSOR)  (parts A,B of 6)
U38  DIFF LINE RECEIVER  Vendor PN: SN65LVDS4RSER  Supplier Part Number 1: 296-46446-1-ND  [QFN-10_1P55X2P05XP6XP5MMP]

### Ports
DSP_FLAG (out), DSP_MVDD (out), DSP_MVSS (out), DSP_RESET_L, DSP_XID0, DSP_XID1, DSP_XID2, DSP_XID3, DSP_YID0, DSP_YID1, DSP_YID2, DSP_YID3, RXI_EA_DATA0_N, RXI_EA_DATA0_P, RXI_EA_DATA1_N, RXI_EA_DATA1_P, RXI_EA_DATA2_N, RXI_EA_DATA2_P, RXI_EA_DATA3_N, RXI_EA_DATA3_P, RXI_EA_DATA4_N, RXI_EA_DATA4_P, RXI_EA_DATA5_N, RXI_EA_DATA5_P, RXI_EA_DATA6_N, RXI_EA_DATA6_P, RXI_EA_DATA7_N, RXI_EA_DATA7_P, RXI_EA_FRAME_N, RXI_EA_FRAME_P, RXI_EA_LCLK_N, RXI_EA_LCLK_P, RXO_EA_RD_WAIT (out), RXO_EA_WR_WAIT_N (out), RXO_EA_WR_WAIT_P (out), TXI_EA_RD_WAIT_N, TXI_EA_RD_WAIT_P, TXI_EA_WR_WAIT_N, TXI_EA_WR_WAIT_P, TXO_EA_DATA0_N (out), TXO_EA_DATA0_P (out), TXO_EA_DATA1_N (out), TXO_EA_DATA1_P (out), TXO_EA_DATA2_N (out), TXO_EA_DATA2_P (out), TXO_EA_DATA3_N (out), TXO_EA_DATA3_P (out), TXO_EA_DATA4_N (out), TXO_EA_DATA4_P (out), TXO_EA_DATA5_N (out), TXO_EA_DATA5_P (out), TXO_EA_DATA6_N (out), TXO_EA_DATA6_P (out), TXO_EA_DATA7_N (out), TXO_EA_DATA7_P (out), TXO_EA_FRAME_N (out), TXO_EA_FRAME_P (out), TXO_EA_LCLK_N (out), TXO_EA_LCLK_P (out)

### Nets
1P8V: CR1.2(A) R156.2 R157.2 R158.2 R159.2 R161.2 R162.2 R163.2 R164.2 R179.2 R222.1
2P5V: C297.2 C298.1 U38.5(VCC) U38.10(VDD)
GND: C297.1 C298.2 R160.2 R165.2 R166.2 R167.2 R168.2 R169.2 R170.2 R171.2 R221.1 U38.1(GND1) U38.7(GND2)  [project net PHY_DIS_REG10]
DSP_RESET_L: U23.F11(RESET_N) ; port DSP_RESET_L
RXO_EA_RD_WAIT_N: R193.2 U23.J17(RXO_EA_RD_WAIT_N) U38.3(B)
RXO_EA_RD_WAIT_P: R193.1 U23.K17(RXO_EA_RD_WAIT_P) U38.2(A)
NetCR1_1: CR1.1(C) R1.2
NetJ13_13: R156.1 R160.1 U23.F12(CSBI_XID0) ; port DSP_XID0
NetJ13_14: R161.1 R168.1 U23.E10(CSBO_YID0) ; port DSP_YID0
NetJ13_15: R157.1 R165.1 U23.E8(SCLKI_XID1) ; port DSP_XID1
NetJ13_16: R162.1 R169.1 U23.E11(SCLKO_YID1) ; port DSP_YID1
NetJ13_17: R158.1 R166.1 U23.F10(SDI_XID2) ; port DSP_XID2
NetJ13_18: R163.1 R170.1 U23.E9(SDO_YID2) ; port DSP_YID2
NetJ13_19: R159.1 R167.1 U23.E7(XID3) ; port DSP_XID3
NetJ13_20: R164.1 R171.1 U23.F9(YID3) ; port DSP_YID3
NetJ13_23: R1.1 R179.1 U23.E12(FLAG) ; port DSP_FLAG
NetR180_1: R180.1 U23.U18(RXI_EA_DATA_P0) ; port RXI_EA_DATA0_P
NetR180_2: R180.2 U23.T18(RXI_EA_DATA_N0) ; port RXI_EA_DATA0_N
NetR181_1: R181.1 U23.T17(RXI_EA_DATA_P1) ; port RXI_EA_DATA1_P
NetR181_2: R181.2 U23.R17(RXI_EA_DATA_N1) ; port RXI_EA_DATA1_N
NetR182_1: R182.1 U23.R16(RXI_EA_DATA_P2) ; port RXI_EA_DATA2_P
NetR182_2: R182.2 U23.P16(RXI_EA_DATA_N2) ; port RXI_EA_DATA2_N
NetR183_1: R183.1 U23.P15(RXI_EA_DATA_P3) ; port RXI_EA_DATA3_P
NetR183_2: R183.2 U23.N15(RXI_EA_DATA_N3) ; port RXI_EA_DATA3_N
NetR184_1: R184.1 U23.R18(RXI_EA_DATA_P4) ; port RXI_EA_DATA4_P
NetR184_2: R184.2 U23.P18(RXI_EA_DATA_N4) ; port RXI_EA_DATA4_N
NetR185_1: R185.1 U23.P17(RXI_EA_DATA_P5) ; port RXI_EA_DATA5_P
NetR185_2: R185.2 U23.N17(RXI_EA_DATA_N5) ; port RXI_EA_DATA5_N
NetR186_1: R186.1 U23.N16(RXI_EA_DATA_P6) ; port RXI_EA_DATA6_P
NetR186_2: R186.2 U23.M16(RXI_EA_DATA_N6) ; port RXI_EA_DATA6_N
NetR187_1: R187.1 U23.M15(RXI_EA_DATA_P7) ; port RXI_EA_DATA7_P
NetR187_2: R187.2 U23.L15(RXI_EA_DATA_N7) ; port RXI_EA_DATA7_N
NetR188_1: R188.1 U23.M17(RXI_EA_FRAME_P) ; port RXI_EA_FRAME_P
NetR188_2: R188.2 U23.L17(RXI_EA_FRAME_N) ; port RXI_EA_FRAME_N
NetR189_1: R189.1 U23.N18(RXI_EA_LCLK_P) ; port RXI_EA_LCLK_P
NetR189_2: R189.2 U23.M18(RXI_EA_LCLK_N) ; port RXI_EA_LCLK_N
NetR190_1: R190.1 U23.H17(TXI_EA_RD_WAIT_P) ; port TXI_EA_RD_WAIT_P
NetR190_2: R190.2 U23.G17(TXI_EA_RD_WAIT_N) ; port TXI_EA_RD_WAIT_N
NetR191_1: R191.1 U23.J16(TXI_EA_WR_WAIT_P) ; port TXI_EA_WR_WAIT_P
NetR191_2: R191.2 U23.H16(TXI_EA_WR_WAIT_N) ; port TXI_EA_WR_WAIT_N
NetR221_2: R221.2 U23.K18(RXI_EA_CCLK_P)
NetR222_2: R222.2 U23.J18(RXI_EA_CCLK_N)
NetU2_H18: U23.K16(RXO_EA_WR_WAIT_N) ; port RXO_EA_WR_WAIT_N
NetU2_H20: U23.J15(TXO_EA_FRAME_N) ; port TXO_EA_FRAME_N
NetU2_J15: U38.8(R) ; port RXO_EA_RD_WAIT
NetU2_J18: U23.L16(RXO_EA_WR_WAIT_P) ; port RXO_EA_WR_WAIT_P
NetU2_J19: U23.G15(TXO_EA_DATA_N0) ; port TXO_EA_DATA0_N
NetU2_J20: U23.K15(TXO_EA_FRAME_P) ; port TXO_EA_FRAME_P
NetU2_K17: U23.G18(TXO_EA_LCLK_P) ; port TXO_EA_LCLK_P
NetU2_K18: U23.F18(TXO_EA_LCLK_N) ; port TXO_EA_LCLK_N
NetU2_K19: U23.H15(TXO_EA_DATA_P0) ; port TXO_EA_DATA0_P
NetU2_L14: U23.G16(TXO_EA_DATA_P1) ; port TXO_EA_DATA1_P
NetU2_L15: U23.F16(TXO_EA_DATA_N1) ; port TXO_EA_DATA1_N
NetU2_L16: U23.F17(TXO_EA_DATA_P2) ; port TXO_EA_DATA2_P
NetU2_L17: U23.E17(TXO_EA_DATA_N2) ; port TXO_EA_DATA2_N
NetU2_L19: U23.F15(TXO_EA_DATA_P4) ; port TXO_EA_DATA4_P
NetU2_L20: U23.E15(TXO_EA_DATA_N4) ; port TXO_EA_DATA4_N
NetU2_M14: U23.E18(TXO_EA_DATA_P3) ; port TXO_EA_DATA3_P
NetU2_M15: U23.D18(TXO_EA_DATA_N3) ; port TXO_EA_DATA3_N
NetU2_M17: U23.D17(TXO_EA_DATA_P6) ; port TXO_EA_DATA6_P
NetU2_M18: U23.C17(TXO_EA_DATA_N6) ; port TXO_EA_DATA6_N
NetU2_M19: U23.E16(TXO_EA_DATA_P5) ; port TXO_EA_DATA5_P
NetU2_M20: U23.D16(TXO_EA_DATA_N5) ; port TXO_EA_DATA5_N
NetU2_N15: U23.C18(TXO_EA_DATA_P7) ; port TXO_EA_DATA7_P
NetU2_N16: U23.B18(TXO_EA_DATA_N7) ; port TXO_EA_DATA7_N
NetU23_F7: U23.F7(MVSS) ; port DSP_MVSS
NetU23_F8: U23.F8(MVDD) ; port DSP_MVDD

Not connected (* = marked no-connect by the designer): U38 4(NC1)* 6(NC2)* 9(NC3)*

### Notes on the sheet
- DSP PROCESSOR 1-OF-3
- 100 Ohm Differential LVDS Signals
- (in symbol EPIPHANY_E16G301, part A) CONTROL/MONITOR
- (in symbol EPIPHANY_E16G301, part B) eLINK - EAST
- (in symbol SN65LVDS4) GND; NC
- (in symbol TitleBlock0) Title; Size; Document Number; Rev; Date:; Sheet; of

### Library data of the parts
C297 C298 = CAP0402_0P1UF_X5R_35V: CAP, 0402, 0.1UF, X5R, 35V; ALT_SYMBOLS: C0402_BGA; Vendor PN: GMK105BJ104KV-F; Vendor: TAIYO YUDEN; DEVICE: CAP0402_0P1UF_X5R_35V; MFG PART NO: GMK105BJ104KV-F; MFG: TAIYO YUDEN; PCB Footprint: C0402
CR1 = LED_0603_5MA_RED: LED, 0603, 5MA, SMT, RED; Voltage: 2V; MFG: LITE-ON INC; MFG PART NO: LTST-C193KRKT-5A; Vendor: LITE-ON INC; PCB Footprint: LED_0603
R1 = RES0402_240: RES, 0402, 240, 1%; MFG PART NO: CRCW0402240RFKED; ALT_SYMBOLS: R0402_BGA; MFG: VISHAY; Vendor: VISHAY/DALE; DEVICE: RES0402_240; Vendor PN: CRCW0402240RFKED; PCB Footprint: R0402
R156-R159 R161-R164 R179 = RES0402_4K75: RES, 0402, 4.75K, 1%; MFG PART NO: CRCW04024K75FKED; MFG: VISHAY; Vendor: VISHAY/DALE; ALT_SYMBOLS: R0402_BGA; DEVICE: RES0402_4K75; Vendor PN: CRCW04024K75FKED; PCB Footprint: R0402
R160 R165-R171 = RES0402_1K: RES, 0402, 1K; MFG PART NO: CRCW04021K00FKED; ALT_SYMBOLS: R0402_BGA; MFG: VISHAY; Vendor: VISHAY/DALE; DEVICE: RES0402_1K; Vendor PN: CRCW04021K00FKED; PCB Footprint: R0402
R180-R191 R193 = RES0402_100: RES, 0402, 100, 1%; ALT_SYMBOLS: R0402_BGA; Vendor PN: CRCW0402100RFKED; Vendor: VISHAY/DALE; MFG: VISHAY; MFG PART NO: CRCW0402100RFKED; DEVICE: RES0402_100; PCB Footprint: R0402
R221 R222 = RES0402_0: RES, 0402, 0 OHM, 1%; MFG PART NO: CRCW04020000Z0ED; ALT_SYMBOLS: R0402_BGA; MFG: VISHAY; Vendor: VISHAY/DALE; DEVICE: RES0402_0; Vendor PN: CRCW04020000Z0ED; PCB Footprint: R0402
U23 = EPIPHANY_E16G301: IC, 16-CORE MICROPROCESSOR, ADAPTEVA, E16G301, BGA324; SPLIT_INST: TRUE; Vendor: ADAPTEVA; DEVICE: EPIPHANY_E16G301; PCB Footprint: BGA324_15SQX1P5_P8MMP; Supplier 1: Digi-Key
U38 = SN65LVDS4: IC, LINE RECEIVER, DIFFERENTIAL LVDS, UFQFN10; Vendor: TEXAS INSTRUMENTS; DEVICE: SN65LVDS4; MFG: TEXAS INSTRUMENTS; MFG PART NO: SN65LVDS4RSER; PCB Footprint: QFN-10_1P55X2P05XP6XP5MMP; Supplier 1: Digi-Key
*#11 = TitleBlock0: Page Create Date: March  8, 1995; Page Modify Date: *

## Sheet 12-DSP PROCESSOR 2-OF-3.SchDoc
size 513 x 386 mm
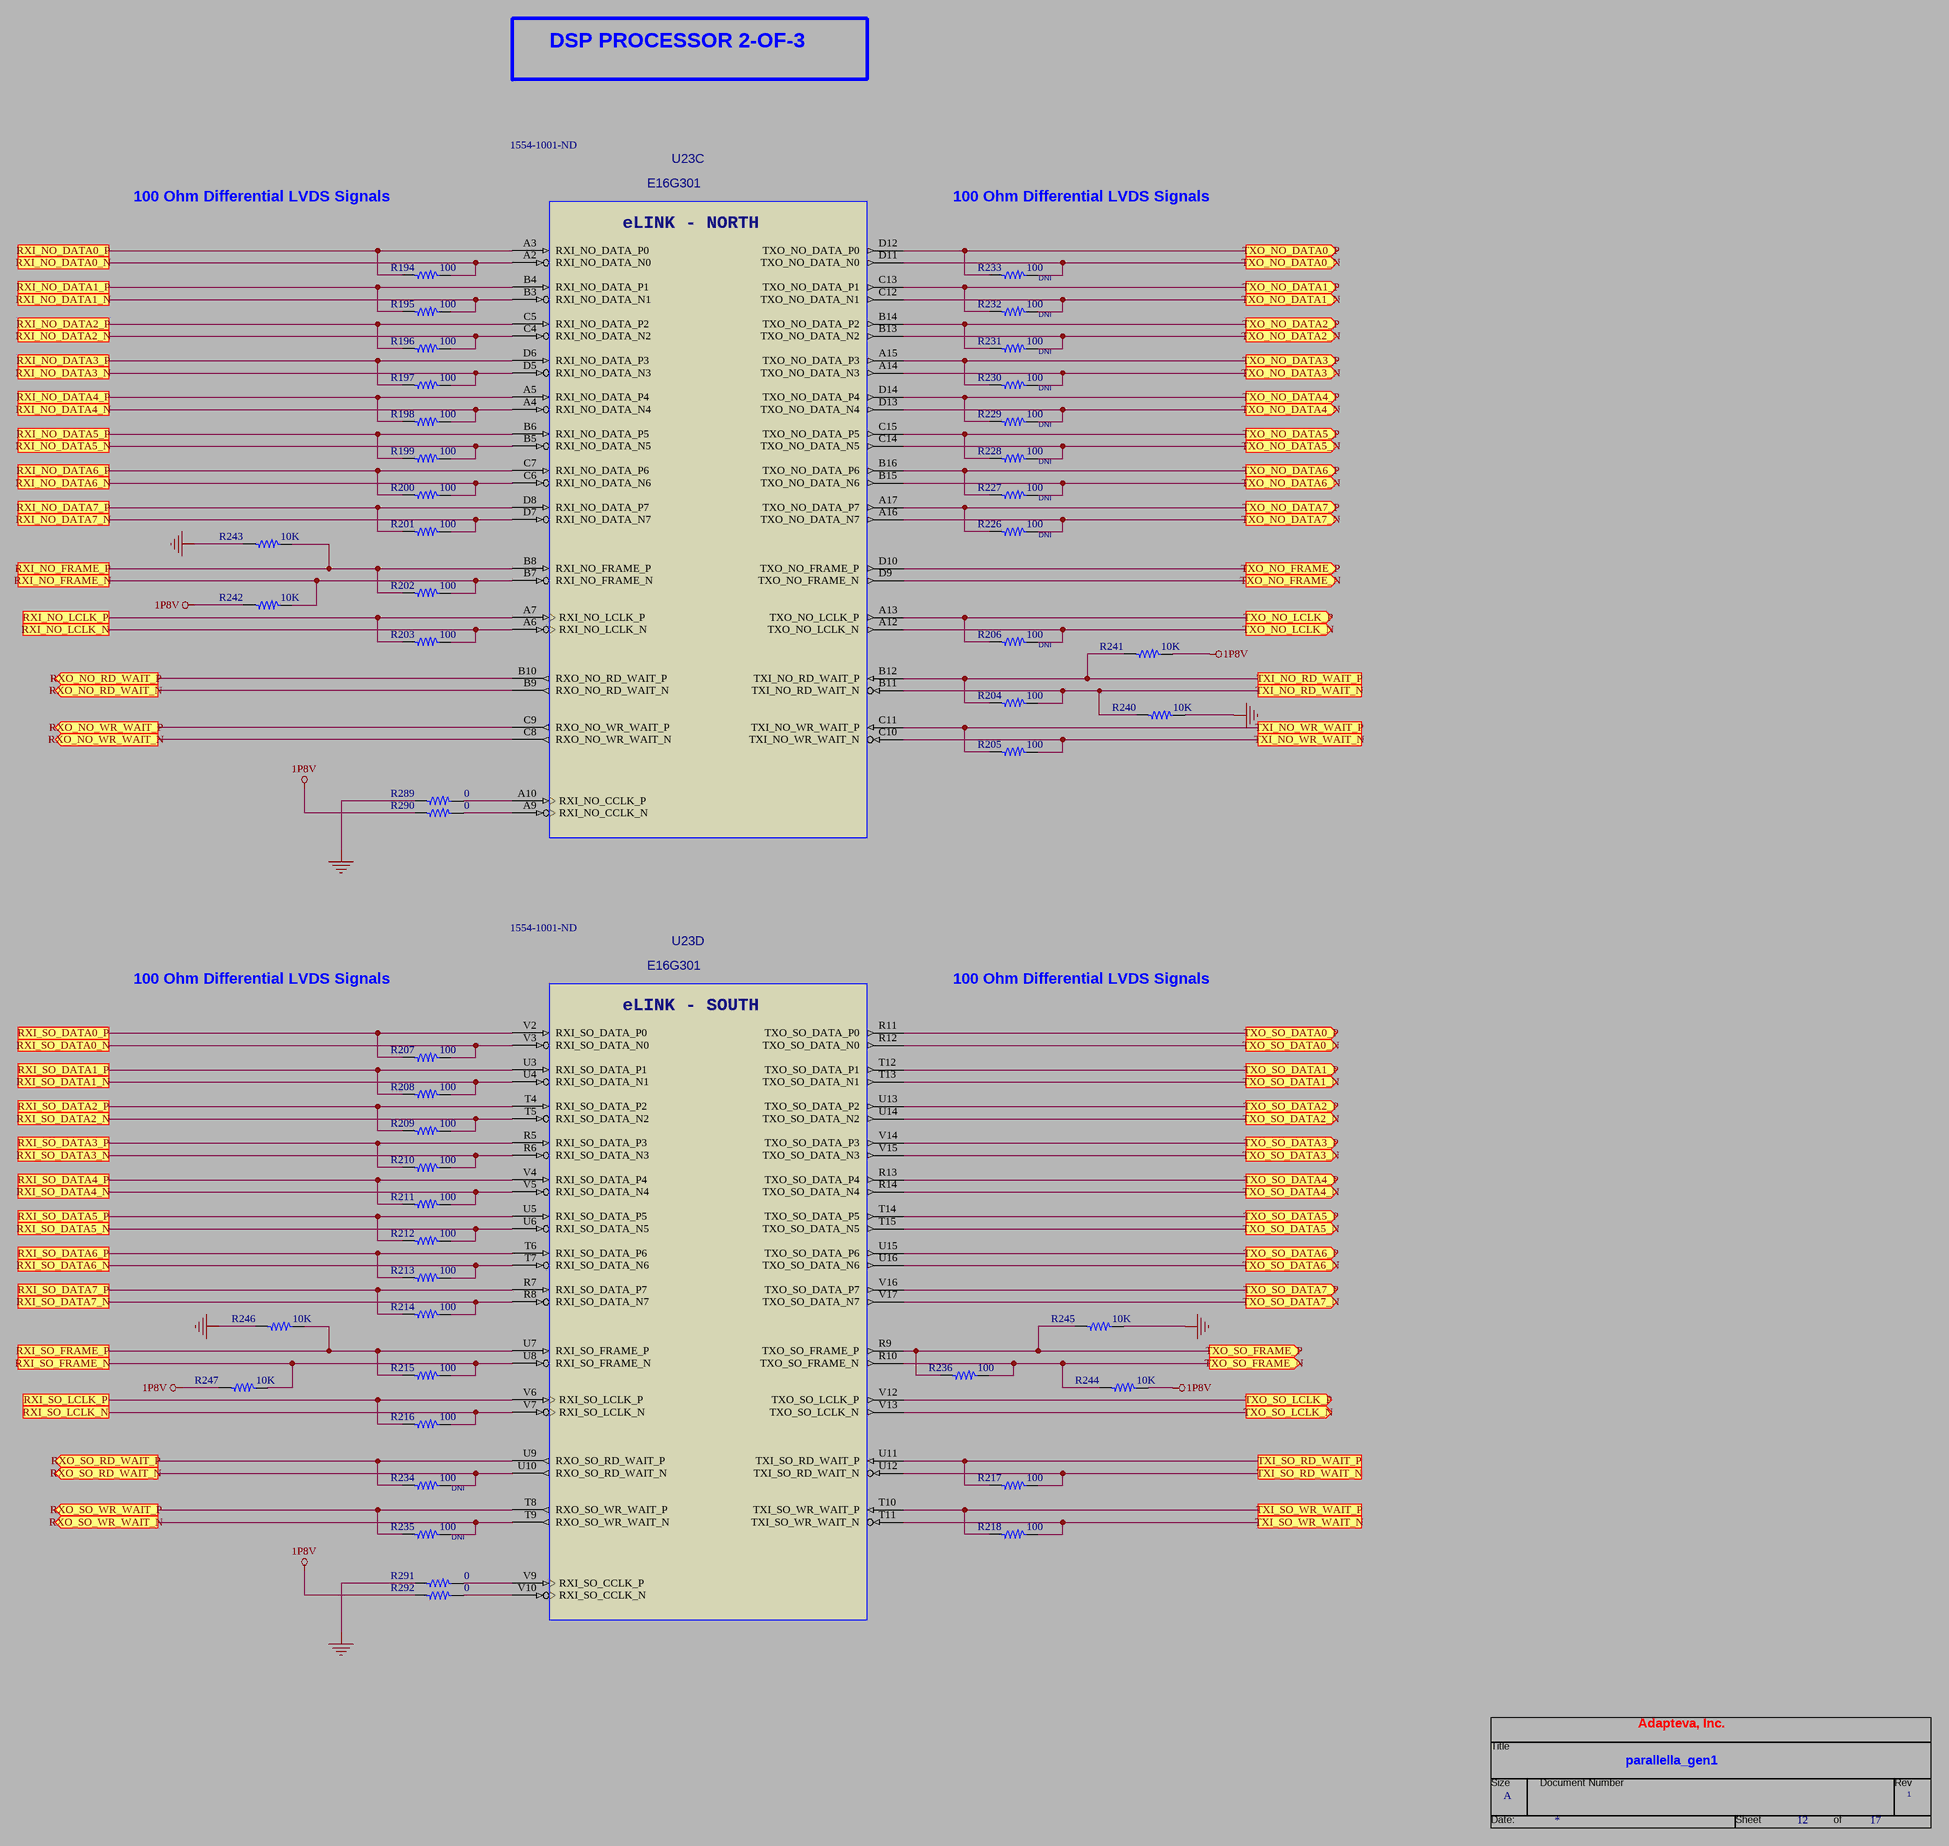
[diagram p16: 12-DSP PROCESSOR 2-OF-3.SchDoc]

### Parts
(Parts that share a designator on the sheet are numbered #1, #2 ... from top to bottom, then left to right.)
*#12  RevCode: 1  Title: parallella_gen1  Page Size: A  Page Number: 12  Page Count: 17  OrgAddr1: Adapteva, Inc.  (hidden comment: TitleBlock0)  (graphical)
R194  100  [R0402]
R195  100  [R0402]
R196  100  [R0402]
R197  100  [R0402]
R198  100  [R0402]
R199  100  [R0402]
R200  100  [R0402]
R201  100  [R0402]
R202  100  [R0402]
R203  100  [R0402]
R204  100  [R0402]
R205  100  [R0402]
R206  100  INSTALL: DNI  [R0402]
R207  100  [R0402]
R208  100  [R0402]
R209  100  [R0402]
R210  100  [R0402]
R211  100  [R0402]
R212  100  [R0402]
R213  100  [R0402]
R214  100  [R0402]
R215  100  [R0402]
R216  100  [R0402]
R217  100  [R0402]
R218  100  [R0402]
R226  100  INSTALL: DNI  [R0402]
R227  100  INSTALL: DNI  [R0402]
R228  100  INSTALL: DNI  [R0402]
R229  100  INSTALL: DNI  [R0402]
R230  100  INSTALL: DNI  [R0402]
R231  100  INSTALL: DNI  [R0402]
R232  100  INSTALL: DNI  [R0402]
R233  100  INSTALL: DNI  [R0402]
R234  100  INSTALL: DNI  [R0402]
R235  100  INSTALL: DNI  [R0402]
R236  100  [R0402]
R240  10K  [R0402]
R241  10K  [R0402]
R242  10K  [R0402]
R243  10K  [R0402]
R244  10K  [R0402]
R245  10K  [R0402]
R246  10K  [R0402]
R247  10K  [R0402]
R289  0  [R0402]
R290  0  [R0402]
R291  0  [R0402]
R292  0  [R0402]
U23  Vendor PN: E16G301  Supplier Part Number 1: 1554-1001-ND  [BGA324_15SQX1P5_P8MMP]  (hidden comment: 16-CORE MICROPROCESSOR)  (parts C,D of 6)

### Ports
RXI_NO_DATA0_N, RXI_NO_DATA0_P, RXI_NO_DATA1_N, RXI_NO_DATA1_P, RXI_NO_DATA2_N, RXI_NO_DATA2_P, RXI_NO_DATA3_N, RXI_NO_DATA3_P, RXI_NO_DATA4_N, RXI_NO_DATA4_P, RXI_NO_DATA5_N, RXI_NO_DATA5_P, RXI_NO_DATA6_N, RXI_NO_DATA6_P, RXI_NO_DATA7_N, RXI_NO_DATA7_P, RXI_NO_FRAME_N, RXI_NO_FRAME_P, RXI_NO_LCLK_N, RXI_NO_LCLK_P, RXI_SO_DATA0_N, RXI_SO_DATA0_P, RXI_SO_DATA1_N, RXI_SO_DATA1_P, RXI_SO_DATA2_N, RXI_SO_DATA2_P, RXI_SO_DATA3_N, RXI_SO_DATA3_P, RXI_SO_DATA4_N, RXI_SO_DATA4_P, RXI_SO_DATA5_N, RXI_SO_DATA5_P, RXI_SO_DATA6_N, RXI_SO_DATA6_P, RXI_SO_DATA7_N, RXI_SO_DATA7_P, RXI_SO_FRAME_N, RXI_SO_FRAME_P, RXI_SO_LCLK_N, RXI_SO_LCLK_P, RXO_NO_RD_WAIT_N (out), RXO_NO_RD_WAIT_P (out), RXO_NO_WR_WAIT_N (out), RXO_NO_WR_WAIT_P (out), RXO_SO_RD_WAIT_N (out), RXO_SO_RD_WAIT_P (out), RXO_SO_WR_WAIT_N (out), RXO_SO_WR_WAIT_P (out), TXI_NO_RD_WAIT_N, TXI_NO_RD_WAIT_P, TXI_NO_WR_WAIT_N, TXI_NO_WR_WAIT_P, TXI_SO_RD_WAIT_N, TXI_SO_RD_WAIT_P, TXI_SO_WR_WAIT_N, TXI_SO_WR_WAIT_P, TXO_NO_DATA0_N (out), TXO_NO_DATA0_P (out), TXO_NO_DATA1_N (out), TXO_NO_DATA1_P (out), TXO_NO_DATA2_N (out), TXO_NO_DATA2_P (out), TXO_NO_DATA3_N (out), TXO_NO_DATA3_P (out), TXO_NO_DATA4_N (out), TXO_NO_DATA4_P (out), TXO_NO_DATA5_N (out), TXO_NO_DATA5_P (out), TXO_NO_DATA6_N (out), TXO_NO_DATA6_P (out), TXO_NO_DATA7_N (out), TXO_NO_DATA7_P (out), TXO_NO_FRAME_N (out), TXO_NO_FRAME_P (out), TXO_NO_LCLK_N (out), TXO_NO_LCLK_P (out), TXO_SO_DATA0_N (out), TXO_SO_DATA0_P (out), TXO_SO_DATA1_N (out), TXO_SO_DATA1_P (out), TXO_SO_DATA2_N (out), TXO_SO_DATA2_P (out), TXO_SO_DATA3_N (out), TXO_SO_DATA3_P (out), TXO_SO_DATA4_N (out), TXO_SO_DATA4_P (out), TXO_SO_DATA5_N (out), TXO_SO_DATA5_P (out), TXO_SO_DATA6_N (out), TXO_SO_DATA6_P (out), TXO_SO_DATA7_N (out), TXO_SO_DATA7_P (out), TXO_SO_FRAME_N (out), TXO_SO_FRAME_P (out), TXO_SO_LCLK_N (out), TXO_SO_LCLK_P (out)

### Nets
1P8V: R241.2 R242.1 R244.2 R247.1 R290.1 R292.1
GND: R240.2 R243.1 R245.2 R246.1 R289.1 R291.1  [project net PHY_DIS_REG10]
NetJ8_3: R194.2 U23.A2(RXI_NO_DATA_N0) ; port RXI_NO_DATA0_N
NetJ8_4: R195.2 U23.B3(RXI_NO_DATA_N1) ; port RXI_NO_DATA1_N
NetJ8_5: R194.1 U23.A3(RXI_NO_DATA_P0) ; port RXI_NO_DATA0_P
NetJ8_6: R195.1 U23.B4(RXI_NO_DATA_P1) ; port RXI_NO_DATA1_P
NetJ8_7: R196.2 U23.C4(RXI_NO_DATA_N2) ; port RXI_NO_DATA2_N
NetJ8_8: R197.2 U23.D5(RXI_NO_DATA_N3) ; port RXI_NO_DATA3_N
NetJ8_9: R196.1 U23.C5(RXI_NO_DATA_P2) ; port RXI_NO_DATA2_P
NetJ8_10: R197.1 U23.D6(RXI_NO_DATA_P3) ; port RXI_NO_DATA3_P
NetJ8_13: R198.2 U23.A4(RXI_NO_DATA_N4) ; port RXI_NO_DATA4_N
NetJ8_14: R199.2 U23.B5(RXI_NO_DATA_N5) ; port RXI_NO_DATA5_N
NetJ8_15: R198.1 U23.A5(RXI_NO_DATA_P4) ; port RXI_NO_DATA4_P
NetJ8_16: R199.1 U23.B6(RXI_NO_DATA_P5) ; port RXI_NO_DATA5_P
NetJ8_17: R200.2 U23.C6(RXI_NO_DATA_N6) ; port RXI_NO_DATA6_N
NetJ8_18: R201.2 U23.D7(RXI_NO_DATA_N7) ; port RXI_NO_DATA7_N
NetJ8_19: R200.1 U23.C7(RXI_NO_DATA_P6) ; port RXI_NO_DATA6_P
NetJ8_20: R201.1 U23.D8(RXI_NO_DATA_P7) ; port RXI_NO_DATA7_P
NetJ8_23: R203.2 U23.A6(RXI_NO_LCLK_N) ; port RXI_NO_LCLK_N
NetJ8_24: R202.2 R242.2 U23.B7(RXI_NO_FRAME_N) ; port RXI_NO_FRAME_N
NetJ8_25: R203.1 U23.A7(RXI_NO_LCLK_P) ; port RXI_NO_LCLK_P
NetJ8_26: R202.1 R243.2 U23.B8(RXI_NO_FRAME_P) ; port RXI_NO_FRAME_P
NetJ8_27: U23.B9(RXO_NO_RD_WAIT_N) ; port RXO_NO_RD_WAIT_N
NetJ8_28: U23.C8(RXO_NO_WR_WAIT_N) ; port RXO_NO_WR_WAIT_N
NetJ8_29: U23.B10(RXO_NO_RD_WAIT_P) ; port RXO_NO_RD_WAIT_P
NetJ8_30: U23.C9(RXO_NO_WR_WAIT_P) ; port RXO_NO_WR_WAIT_P
NetJ8_33: U23.D9(TXO_NO_FRAME_N) ; port TXO_NO_FRAME_N
NetJ8_34: R205.2 U23.C10(TXI_NO_WR_WAIT_N) ; port TXI_NO_WR_WAIT_N
NetJ8_35: U23.D10(TXO_NO_FRAME_P) ; port TXO_NO_FRAME_P
NetJ8_36: R205.1 U23.C11(TXI_NO_WR_WAIT_P) ; port TXI_NO_WR_WAIT_P
NetJ8_37: R206.2 U23.A12(TXO_NO_LCLK_N) ; port TXO_NO_LCLK_N
NetJ8_38: R204.2 R240.1 U23.B11(TXI_NO_RD_WAIT_N) ; port TXI_NO_RD_WAIT_N
NetJ8_39: R206.1 U23.A13(TXO_NO_LCLK_P) ; port TXO_NO_LCLK_P
NetJ8_40: R204.1 R241.1 U23.B12(TXI_NO_RD_WAIT_P) ; port TXI_NO_RD_WAIT_P
NetJ8_43: R233.2 U23.D11(TXO_NO_DATA_N0) ; port TXO_NO_DATA0_N
NetJ8_44: R232.2 U23.C12(TXO_NO_DATA_N1) ; port TXO_NO_DATA1_N
NetJ8_45: R233.1 U23.D12(TXO_NO_DATA_P0) ; port TXO_NO_DATA0_P
NetJ8_46: R232.1 U23.C13(TXO_NO_DATA_P1) ; port TXO_NO_DATA1_P
NetJ8_47: R231.2 U23.B13(TXO_NO_DATA_N2) ; port TXO_NO_DATA2_N
NetJ8_48: R230.2 U23.A14(TXO_NO_DATA_N3) ; port TXO_NO_DATA3_N
NetJ8_49: R231.1 U23.B14(TXO_NO_DATA_P2) ; port TXO_NO_DATA2_P
NetJ8_50: R230.1 U23.A15(TXO_NO_DATA_P3) ; port TXO_NO_DATA3_P
NetJ8_53: R229.2 U23.D13(TXO_NO_DATA_N4) ; port TXO_NO_DATA4_N
NetJ8_54: R228.2 U23.C14(TXO_NO_DATA_N5) ; port TXO_NO_DATA5_N
NetJ8_55: R229.1 U23.D14(TXO_NO_DATA_P4) ; port TXO_NO_DATA4_P
NetJ8_56: R228.1 U23.C15(TXO_NO_DATA_P5) ; port TXO_NO_DATA5_P
NetJ8_57: R227.2 U23.B15(TXO_NO_DATA_N6) ; port TXO_NO_DATA6_N
NetJ8_58: R226.2 U23.A16(TXO_NO_DATA_N7) ; port TXO_NO_DATA7_N
NetJ8_59: R227.1 U23.B16(TXO_NO_DATA_P6) ; port TXO_NO_DATA6_P
NetJ8_60: R226.1 U23.A17(TXO_NO_DATA_P7) ; port TXO_NO_DATA7_P
NetJ9_3: R207.2 U23.V3(RXI_SO_DATA_N0) ; port RXI_SO_DATA0_N
NetJ9_4: R208.2 U23.U4(RXI_SO_DATA_N1) ; port RXI_SO_DATA1_N
NetJ9_5: R207.1 U23.V2(RXI_SO_DATA_P0) ; port RXI_SO_DATA0_P
NetJ9_6: R208.1 U23.U3(RXI_SO_DATA_P1) ; port RXI_SO_DATA1_P
NetJ9_7: R209.2 U23.T5(RXI_SO_DATA_N2) ; port RXI_SO_DATA2_N
NetJ9_8: R210.2 U23.R6(RXI_SO_DATA_N3) ; port RXI_SO_DATA3_N
NetJ9_9: R209.1 U23.T4(RXI_SO_DATA_P2) ; port RXI_SO_DATA2_P
NetJ9_10: R210.1 U23.R5(RXI_SO_DATA_P3) ; port RXI_SO_DATA3_P
NetJ9_13: R211.2 U23.V5(RXI_SO_DATA_N4) ; port RXI_SO_DATA4_N
NetJ9_14: R212.2 U23.U6(RXI_SO_DATA_N5) ; port RXI_SO_DATA5_N
NetJ9_15: R211.1 U23.V4(RXI_SO_DATA_P4) ; port RXI_SO_DATA4_P
NetJ9_16: R212.1 U23.U5(RXI_SO_DATA_P5) ; port RXI_SO_DATA5_P
NetJ9_17: R213.2 U23.T7(RXI_SO_DATA_N6) ; port RXI_SO_DATA6_N
NetJ9_18: R214.2 U23.R8(RXI_SO_DATA_N7) ; port RXI_SO_DATA7_N
NetJ9_19: R213.1 U23.T6(RXI_SO_DATA_P6) ; port RXI_SO_DATA6_P
NetJ9_20: R214.1 U23.R7(RXI_SO_DATA_P7) ; port RXI_SO_DATA7_P
NetJ9_23: R216.2 U23.V7(RXI_SO_LCLK_N) ; port RXI_SO_LCLK_N
NetJ9_24: R215.2 R247.2 U23.U8(RXI_SO_FRAME_N) ; port RXI_SO_FRAME_N
NetJ9_25: R216.1 U23.V6(RXI_SO_LCLK_P) ; port RXI_SO_LCLK_P
NetJ9_26: R215.1 R246.2 U23.U7(RXI_SO_FRAME_P) ; port RXI_SO_FRAME_P
NetJ9_27: R234.2 U23.U10(RXO_SO_RD_WAIT_N) ; port RXO_SO_RD_WAIT_N
NetJ9_28: R235.2 U23.T9(RXO_SO_WR_WAIT_N) ; port RXO_SO_WR_WAIT_N
NetJ9_29: R234.1 U23.U9(RXO_SO_RD_WAIT_P) ; port RXO_SO_RD_WAIT_P
NetJ9_30: R235.1 U23.T8(RXO_SO_WR_WAIT_P) ; port RXO_SO_WR_WAIT_P
NetJ9_33: R236.2 R244.1 U23.R10(TXO_SO_FRAME_N) ; port TXO_SO_FRAME_N
NetJ9_34: R218.2 U23.T11(TXI_SO_WR_WAIT_N) ; port TXI_SO_WR_WAIT_N
NetJ9_35: R236.1 R245.1 U23.R9(TXO_SO_FRAME_P) ; port TXO_SO_FRAME_P
NetJ9_36: R218.1 U23.T10(TXI_SO_WR_WAIT_P) ; port TXI_SO_WR_WAIT_P
NetJ9_37: U23.V13(TXO_SO_LCLK_N) ; port TXO_SO_LCLK_N
NetJ9_38: R217.2 U23.U12(TXI_SO_RD_WAIT_N) ; port TXI_SO_RD_WAIT_N
NetJ9_39: U23.V12(TXO_SO_LCLK_P) ; port TXO_SO_LCLK_P
NetJ9_40: R217.1 U23.U11(TXI_SO_RD_WAIT_P) ; port TXI_SO_RD_WAIT_P
NetJ9_43: U23.R12(TXO_SO_DATA_N0) ; port TXO_SO_DATA0_N
NetJ9_44: U23.T13(TXO_SO_DATA_N1) ; port TXO_SO_DATA1_N
NetJ9_45: U23.R11(TXO_SO_DATA_P0) ; port TXO_SO_DATA0_P
NetJ9_46: U23.T12(TXO_SO_DATA_P1) ; port TXO_SO_DATA1_P
NetJ9_47: U23.U14(TXO_SO_DATA_N2) ; port TXO_SO_DATA2_N
NetJ9_48: U23.V15(TXO_SO_DATA_N3) ; port TXO_SO_DATA3_N
NetJ9_49: U23.U13(TXO_SO_DATA_P2) ; port TXO_SO_DATA2_P
NetJ9_50: U23.V14(TXO_SO_DATA_P3) ; port TXO_SO_DATA3_P
NetJ9_53: U23.R14(TXO_SO_DATA_N4) ; port TXO_SO_DATA4_N
NetJ9_54: U23.T15(TXO_SO_DATA_N5) ; port TXO_SO_DATA5_N
NetJ9_55: U23.R13(TXO_SO_DATA_P4) ; port TXO_SO_DATA4_P
NetJ9_56: U23.T14(TXO_SO_DATA_P5) ; port TXO_SO_DATA5_P
NetJ9_57: U23.U16(TXO_SO_DATA_N6) ; port TXO_SO_DATA6_N
NetJ9_58: U23.V17(TXO_SO_DATA_N7) ; port TXO_SO_DATA7_N
NetJ9_59: U23.U15(TXO_SO_DATA_P6) ; port TXO_SO_DATA6_P
NetJ9_60: U23.V16(TXO_SO_DATA_P7) ; port TXO_SO_DATA7_P
NetR289_2: R289.2 U23.A10(RXI_NO_CCLK_P)
NetR290_2: R290.2 U23.A9(RXI_NO_CCLK_N)
NetR291_2: R291.2 U23.V9(RXI_SO_CCLK_P)
NetR292_2: R292.2 U23.V10(RXI_SO_CCLK_N)

### Notes on the sheet
- DSP PROCESSOR 2-OF-3
- 100 Ohm Differential LVDS Signals
- (in symbol EPIPHANY_E16G301, part C) eLINK - NORTH
- (in symbol EPIPHANY_E16G301, part D) eLINK - SOUTH
- (in symbol TitleBlock0) Title; Size; Document Number; Rev; Date:; Sheet; of

### Library data of the parts
R194-R218 R226-R236 = RES0402_100: as R180-R191 on sheet 11-DSP PROCESSOR 1-OF-3; MFG PART NO: CRCW0402100RFKED; DEVICE: RES0402_100; PCB Footprint: R0402
R240-R247 = RES0402_10K: RES, 0402, 10K; MFG PART NO: CRCW040210K0FKED; ALT_SYMBOLS: R0402_BGA; MFG: VISHAY; Vendor: VISHAY/DALE; DEVICE: RES0402_10K; Vendor PN: CRCW040210K0FKED; PCB Footprint: R0402
R289-R292 = RES0402_0: as R221 on sheet 11-DSP PROCESSOR 1-OF-3; DEVICE: RES0402_0; Vendor PN: CRCW04020000Z0ED; PCB Footprint: R0402
U23 = EPIPHANY_E16G301: as U23 on sheet 11-DSP PROCESSOR 1-OF-3; Vendor: ADAPTEVA; DEVICE: EPIPHANY_E16G301; PCB Footprint: BGA324_15SQX1P5_P8MMP; Supplier 1: Digi-Key
*#12 = TitleBlock0: Page Create Date: March  8, 1995; Page Modify Date: *

## Sheet 13-DSP PROCESSOR 3-OF-3.SchDoc
size 513 x 386 mm
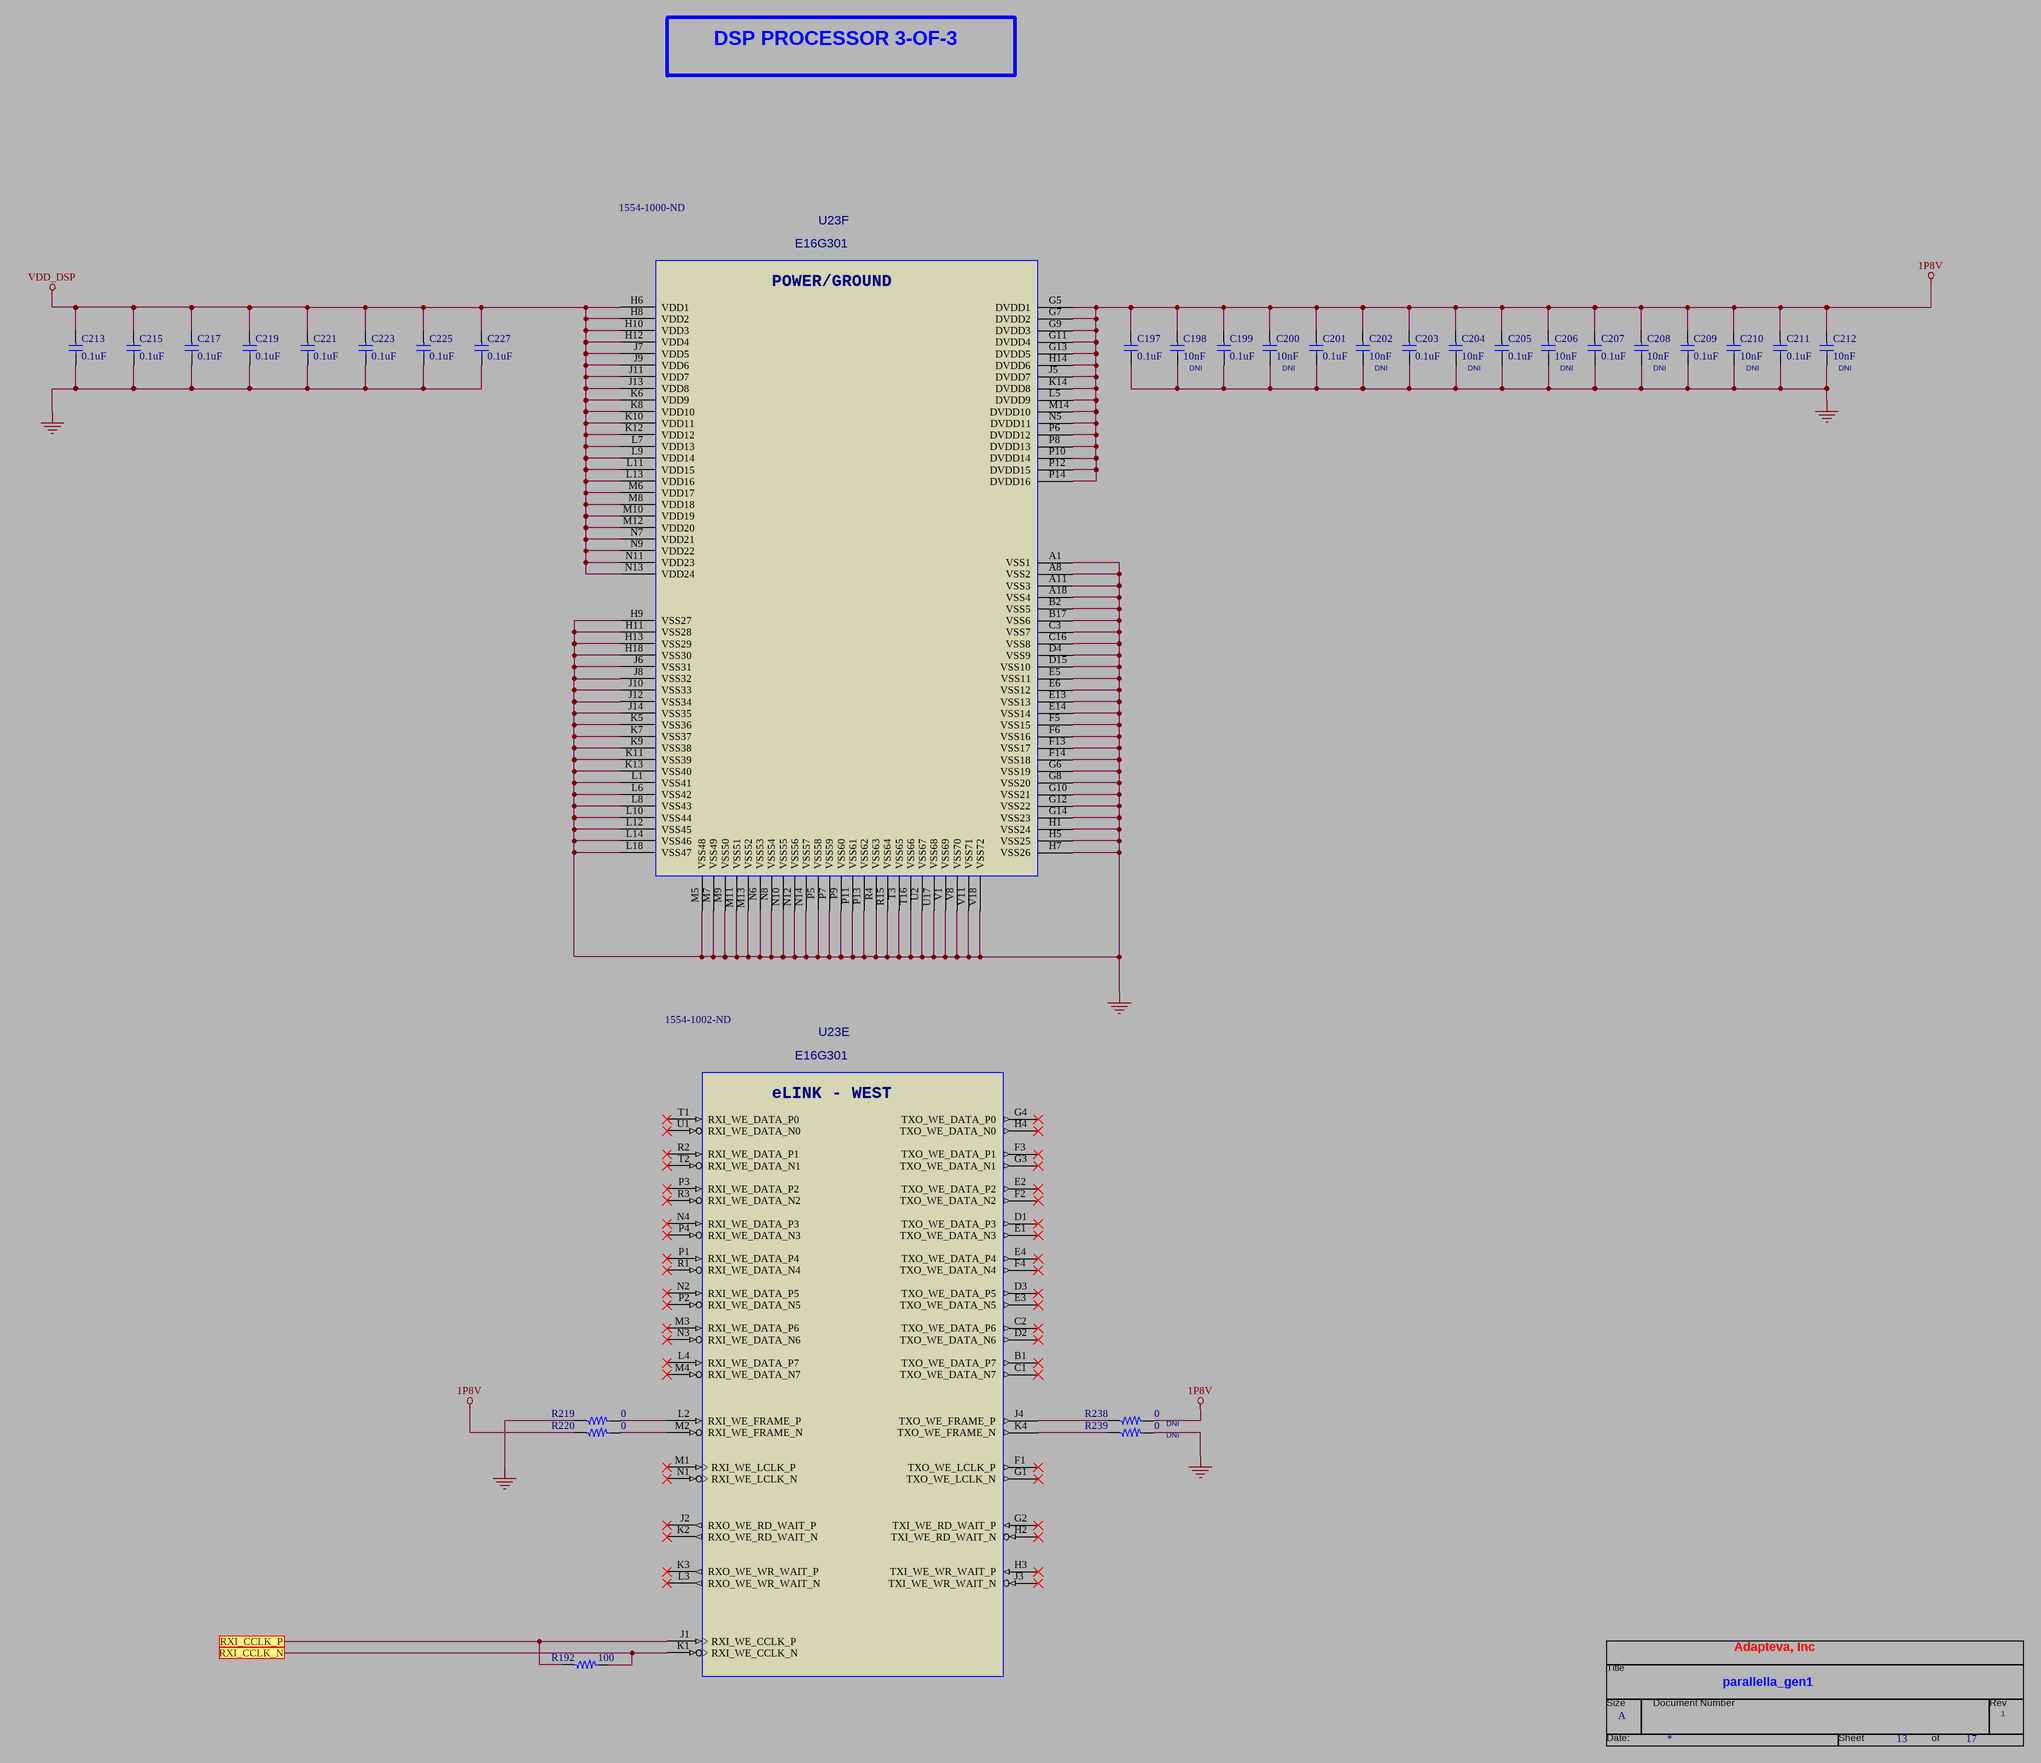
[diagram p17: 13-DSP PROCESSOR 3-OF-3.SchDoc]

### Parts
(Parts that share a designator on the sheet are numbered #1, #2 ... from top to bottom, then left to right.)
*#13  RevCode: 1  Title: parallella_gen1  Page Size: A  Page Number: 13  Page Count: 17  OrgAddr1: Adapteva, Inc  (hidden comment: TitleBlock0)  (graphical)
C197  0.1uF  [C0402]
C198  10nF  INSTALL: DNI  [C0402]
C199  0.1uF  [C0402]
C200  10nF  INSTALL: DNI  [C0402]
C201  0.1uF  [C0402]
C202  10nF  INSTALL: DNI  [C0402]
C203  0.1uF  [C0402]
C204  10nF  INSTALL: DNI  [C0402]
C205  0.1uF  [C0402]
C206  10nF  INSTALL: DNI  [C0402]
C207  0.1uF  [C0402]
C208  10nF  INSTALL: DNI  [C0402]
C209  0.1uF  [C0402]
C210  10nF  INSTALL: DNI  [C0402]
C211  0.1uF  [C0402]
C212  10nF  INSTALL: DNI  [C0402]
C213  0.1uF  [C0402]
C215  0.1uF  [C0402]
C217  0.1uF  [C0402]
C219  0.1uF  [C0402]
C221  0.1uF  [C0402]
C223  0.1uF  [C0402]
C225  0.1uF  [C0402]
C227  0.1uF  [C0402]
R192  100  [R0402]
R219  0  [R0402]
R220  0  [R0402]
R238  0  INSTALL: DNI  [R0402]
R239  0  INSTALL: DNI  [R0402]
U23  Vendor PN: E16G301  Supplier Part Number 1: 1554-1002-ND  [BGA324_15SQX1P5_P8MMP]  (hidden comment: 16-CORE MICROPROCESSOR)  (parts E,F of 6)

### Ports
RXI_CCLK_N, RXI_CCLK_P

### Nets
1P8V: C197.1 C198.1 C199.1 C200.1 C201.1 C202.1 C203.1 C204.1 C205.1 C206.1 C207.1 C208.1 C209.1 C210.1 C211.1 C212.1 R220.1 R238.2 U23.G5(DVDD1) U23.G7(DVDD2) U23.G9(DVDD3) U23.G11(DVDD4) U23.G13(DVDD5) U23.H14(DVDD6) U23.J5(DVDD7) U23.K14(DVDD8) U23.L5(DVDD9) U23.M14(DVDD10) U23.N5(DVDD11) U23.P6(DVDD12) U23.P8(DVDD13) U23.P10(DVDD14) U23.P12(DVDD15) U23.P14(DVDD16)
GND: C197.2 C198.2 C199.2 C200.2 C201.2 C202.2 C203.2 C204.2 C205.2 C206.2 C207.2 C208.2 C209.2 C210.2 C211.2 C212.2 C213.2 C215.2 C217.2 C219.2 C221.2 C223.2 C225.2 C227.2 R219.1 R239.2 U23.A1(VSS1) U23.A8(VSS2) U23.A11(VSS3) U23.A18(VSS4) U23.B2(VSS5) U23.B17(VSS6) U23.C3(VSS7) U23.C16(VSS8) U23.D4(VSS9) U23.D15(VSS10) U23.E5(VSS11) U23.E6(VSS12) U23.E13(VSS13) U23.E14(VSS14) U23.F5(VSS15) U23.F6(VSS16) U23.F13(VSS17) U23.F14(VSS18) U23.G6(VSS19) U23.G8(VSS20) U23.G10(VSS21) U23.G12(VSS22) U23.G14(VSS23) U23.H1(VSS24) U23.H5(VSS25) U23.H7(VSS26) U23.H9(VSS27) U23.H11(VSS28) U23.H13(VSS29) U23.H18(VSS30) U23.J6(VSS31) U23.J8(VSS32) U23.J10(VSS33) U23.J12(VSS34) U23.J14(VSS35) U23.K5(VSS36) U23.K7(VSS37) U23.K9(VSS38) U23.K11(VSS39) U23.K13(VSS40) U23.L1(VSS41) U23.L6(VSS42) U23.L8(VSS43) U23.L10(VSS44) U23.L12(VSS45) U23.L14(VSS46) U23.L18(VSS47) U23.M5(VSS48) U23.M7(VSS49) U23.M9(VSS50) U23.M11(VSS51) U23.M13(VSS52) U23.N6(VSS53) U23.N8(VSS54) U23.N10(VSS55) U23.N12(VSS56) U23.N14(VSS57) U23.P5(VSS58) U23.P7(VSS59) U23.P9(VSS60) U23.P11(VSS61) U23.P13(VSS62) U23.R4(VSS63) U23.R15(VSS64) U23.T3(VSS65) U23.T16(VSS66) U23.U2(VSS67) U23.U17(VSS68) U23.V1(VSS69) U23.V8(VSS70) U23.V11(VSS71) U23.V18(VSS72)  [project net PHY_DIS_REG10]
VDD_DSP: C213.1 C215.1 C217.1 C219.1 C221.1 C223.1 C225.1 C227.1 U23.H6(VDD1) U23.H8(VDD2) U23.H10(VDD3) U23.H12(VDD4) U23.J7(VDD5) U23.J9(VDD6) U23.J11(VDD7) U23.J13(VDD8) U23.K6(VDD9) U23.K8(VDD10) U23.K10(VDD11) U23.K12(VDD12) U23.L7(VDD13) U23.L9(VDD14) U23.L11(VDD15) U23.L13(VDD16) U23.M6(VDD17) U23.M8(VDD18) U23.M10(VDD19) U23.M12(VDD20) U23.N7(VDD21) U23.N9(VDD22) U23.N11(VDD23) U23.N13(VDD24)
NetR192_1: R192.1 U23.J1(RXI_WE_CCLK_P) ; port RXI_CCLK_P
NetR192_2: R192.2 U23.K1(RXI_WE_CCLK_N) ; port RXI_CCLK_N
NetR219_2: R219.2 U23.L2(RXI_WE_FRAME_P)
NetR220_2: R220.2 U23.M2(RXI_WE_FRAME_N)
NetR238_1: R238.1 U23.J4(TXO_WE_FRAME_P)
NetR239_1: R239.1 U23.K4(TXO_WE_FRAME_N)

Not connected (* = marked no-connect by the designer): U23 B1(TXO_WE_DATA_P7)* C1(TXO_WE_DATA_N7)* C2(TXO_WE_DATA_P6)* D1(TXO_WE_DATA_P3)* D2(TXO_WE_DATA_N6)* D3(TXO_WE_DATA_P5)* E1(TXO_WE_DATA_N3)* E2(TXO_WE_DATA_P2)* E3(TXO_WE_DATA_N5)* E4(TXO_WE_DATA_P4)* F1(TXO_WE_LCLK_P)* F2(TXO_WE_DATA_N2)* F3(TXO_WE_DATA_P1)* F4(TXO_WE_DATA_N4)* G1(TXO_WE_LCLK_N)* G2(TXI_WE_RD_WAIT_P)* G3(TXO_WE_DATA_N1)* G4(TXO_WE_DATA_P0)* H2(TXI_WE_RD_WAIT_N)* H3(TXI_WE_WR_WAIT_P)* H4(TXO_WE_DATA_N0)* J2(RXO_WE_RD_WAIT_P)* J3(TXI_WE_WR_WAIT_N)* K2(RXO_WE_RD_WAIT_N)* K3(RXO_WE_WR_WAIT_P)* L3(RXO_WE_WR_WAIT_N)* L4(RXI_WE_DATA_P7)* M1(RXI_WE_LCLK_P)* M3(RXI_WE_DATA_P6)* M4(RXI_WE_DATA_N7)* N1(RXI_WE_LCLK_N)* N2(RXI_WE_DATA_P5)* N3(RXI_WE_DATA_N6)* N4(RXI_WE_DATA_P3)* P1(RXI_WE_DATA_P4)* P2(RXI_WE_DATA_N5)* P3(RXI_WE_DATA_P2)* P4(RXI_WE_DATA_N3)* R1(RXI_WE_DATA_N4)* R2(RXI_WE_DATA_P1)* R3(RXI_WE_DATA_N2)* T1(RXI_WE_DATA_P0)* T2(RXI_WE_DATA_N1)* U1(RXI_WE_DATA_N0)*

### Notes on the sheet
- DSP PROCESSOR 3-OF-3
- (in symbol EPIPHANY_E16G301, part E) eLINK - WEST
- (in symbol EPIPHANY_E16G301, part F) POWER/GROUND
- (in symbol TitleBlock0) Title; Size; Document Number; Rev; Date:; Sheet; of

### Library data of the parts
C197 C199 C201 C203 C205 C207 C209 C211 C213 C215 C217 C219 C221 C223 C225 C227 = CAP0402_0P1UF_X5R_35V: as C297 on sheet 11-DSP PROCESSOR 1-OF-3; DEVICE: CAP0402_0P1UF_X5R_35V; MFG PART NO: GMK105BJ104KV-F; MFG: TAIYO YUDEN; PCB Footprint: C0402
C198 C200 C202 C204 C206 C208 C210 C212 = CAP0402_10NF_X7R_16V: CAP, 0402, 10NF, X7R, 16V; MFG PART NO: C1005X7R1C103K; MFG: TDK; ALT_SYMBOLS: C0402_BGA; Vendor: TDK; Vendor PN: C1005X7R1C103K; PCB Footprint: C0402
R192 = RES0402_100: as R180-R191 on sheet 11-DSP PROCESSOR 1-OF-3; MFG PART NO: CRCW0402100RFKED; DEVICE: RES0402_100; PCB Footprint: R0402
R219 R220 R238 R239 = RES0402_0: as R221 on sheet 11-DSP PROCESSOR 1-OF-3; DEVICE: RES0402_0; Vendor PN: CRCW04020000Z0ED; PCB Footprint: R0402
U23 = EPIPHANY_E16G301: as U23 on sheet 11-DSP PROCESSOR 1-OF-3; Vendor: ADAPTEVA; DEVICE: EPIPHANY_E16G301; PCB Footprint: BGA324_15SQX1P5_P8MMP; Supplier 1: Digi-Key
*#13 = TitleBlock0: Page Create Date: March  8, 1995; Page Modify Date: *

## Sheet 14-DSP eLINK CONNECTORS.SchDoc
size 513 x 386 mm
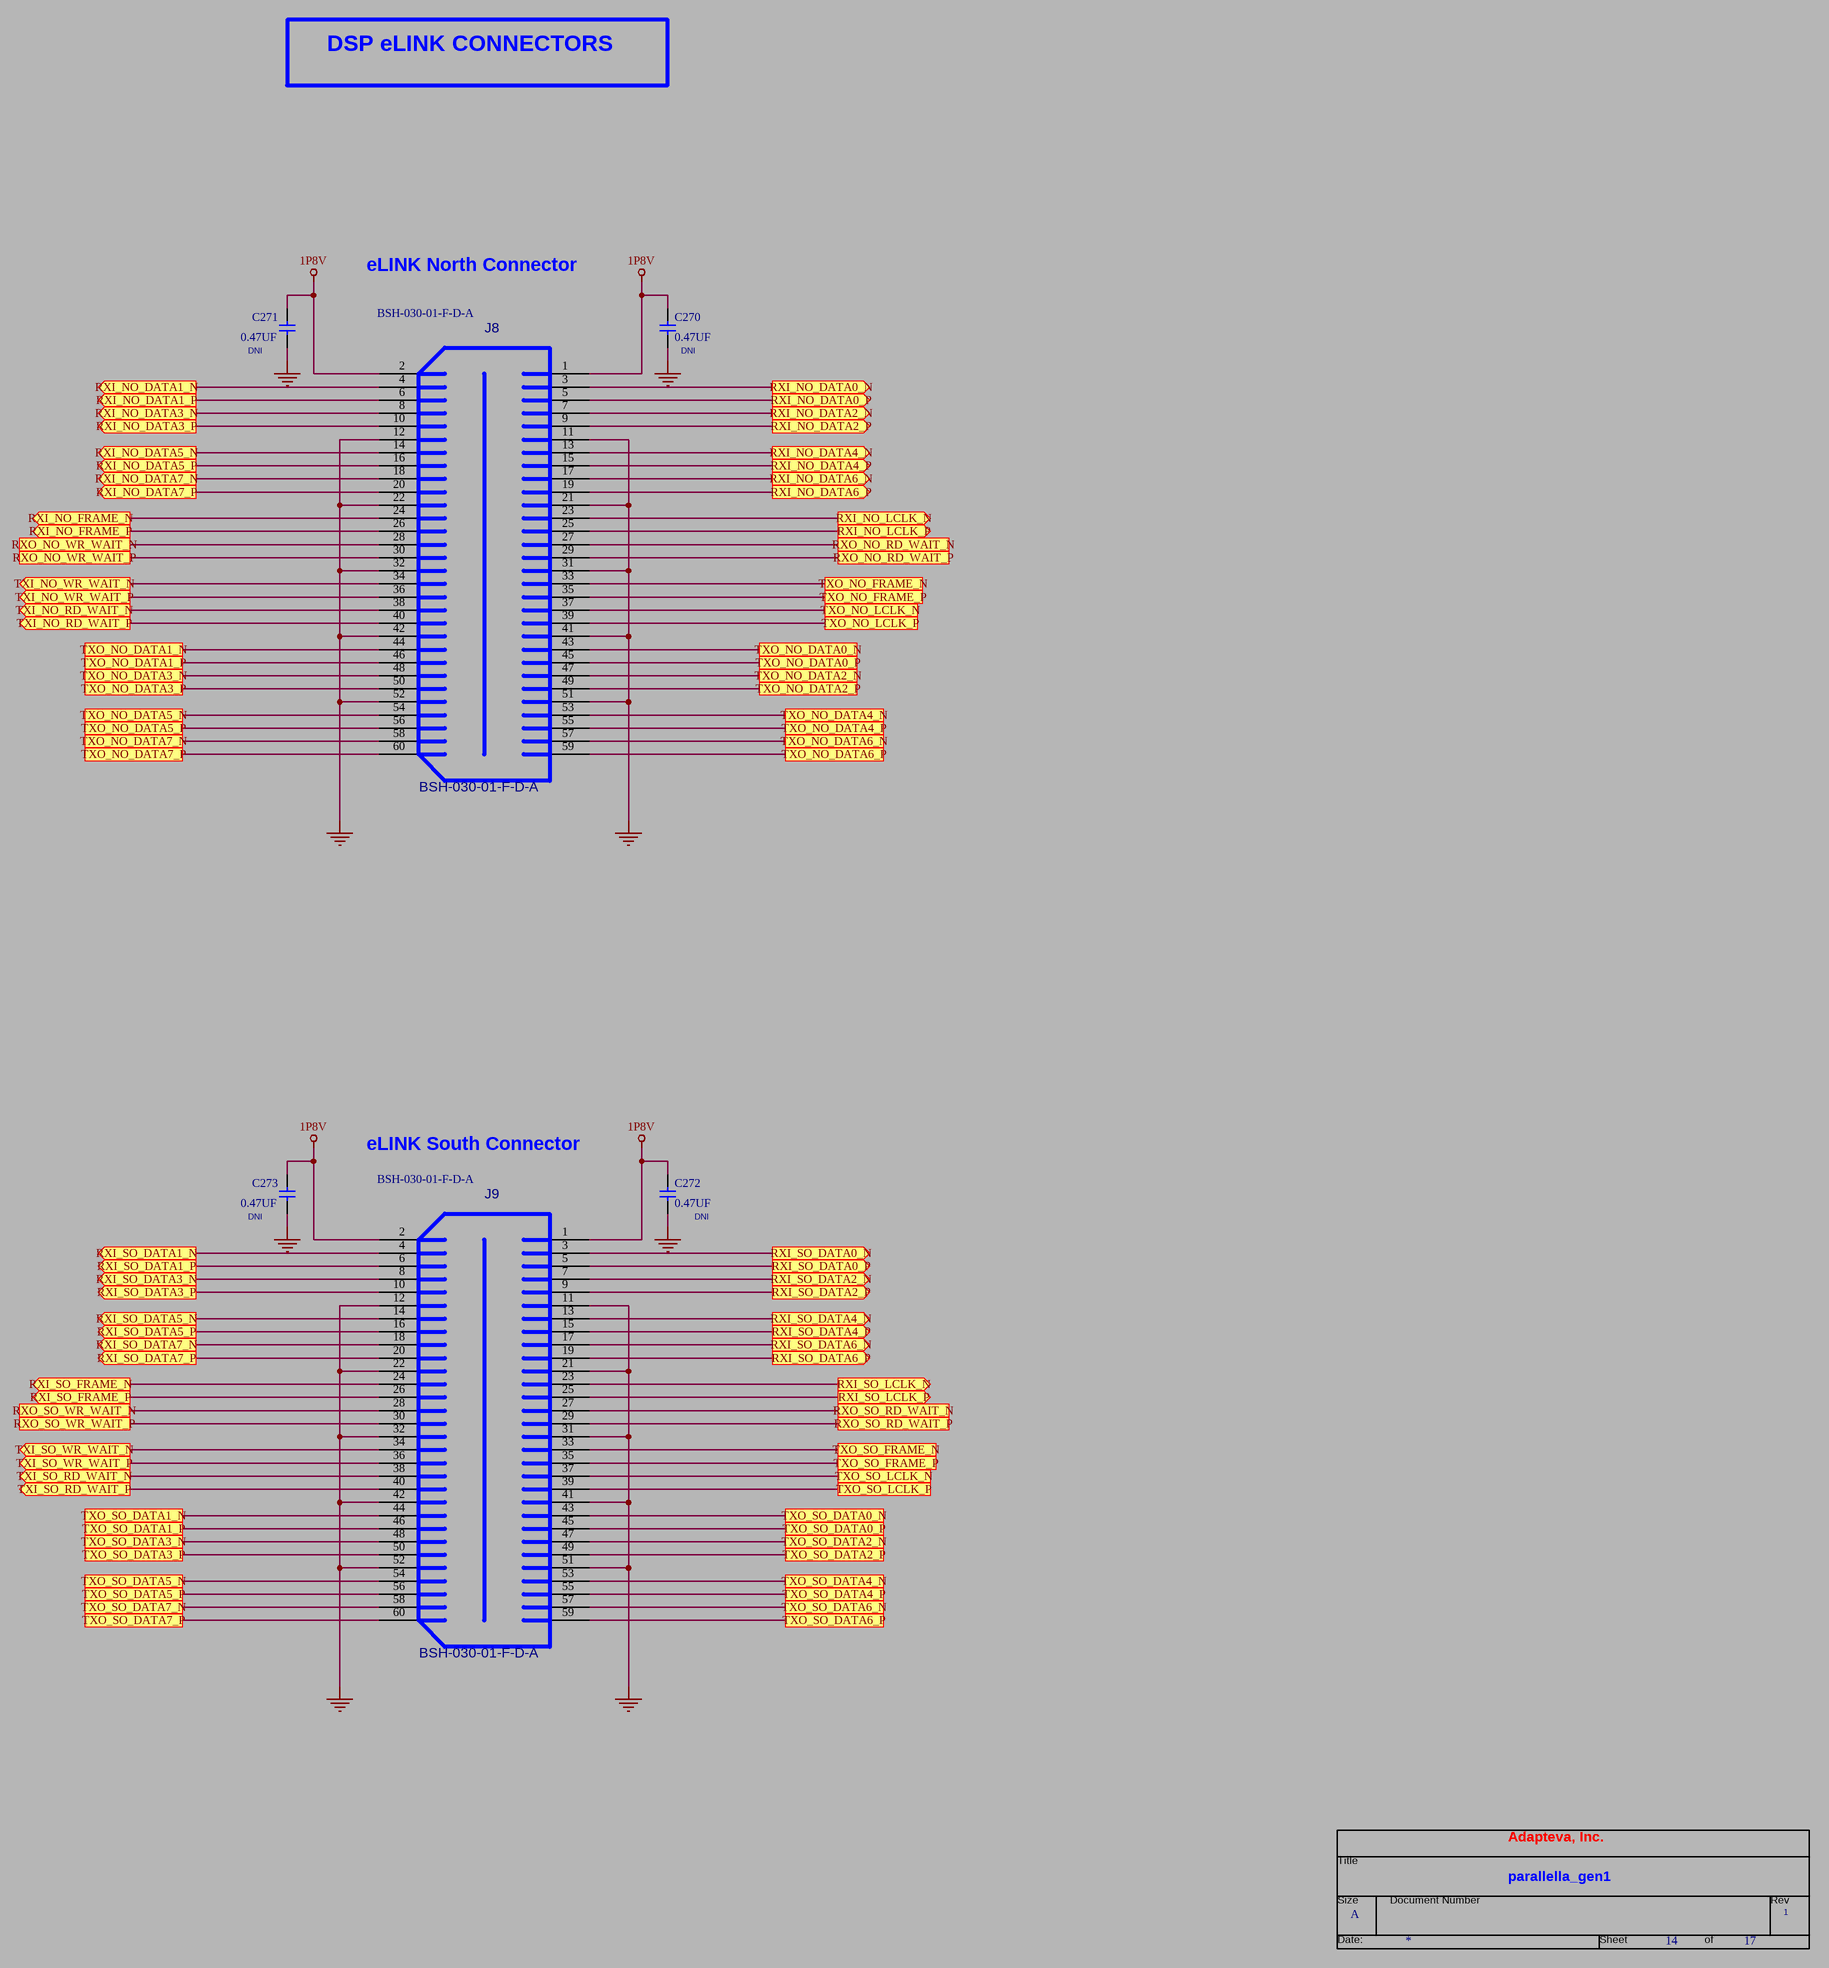
[diagram p18: 14-DSP eLINK CONNECTORS.SchDoc]

### Parts
(Parts that share a designator on the sheet are numbered #1, #2 ... from top to bottom, then left to right.)
*#14  RevCode: 1  Title: parallella_gen1  Page Size: A  Page Number: 14  Page Count: 17  OrgAddr1: Adapteva, Inc.  (hidden comment: TitleBlock0)  (graphical)
C270  0.47UF  INSTALL: DNI  [C0402]
C271  0.47UF  INSTALL: DNI  [C0402]
C272  0.47UF  INSTALL: DNI  [C0402]
C273  0.47UF  INSTALL: DNI  [C0402]
J8  BSH-030-01-F-D-A  [CONN_BSH60P_13P59X25P88_P5P_V]
J9  BSH-030-01-F-D-A  [CONN_BSH60P_13P59X25P88_P5P_V]

### Ports
RXI_NO_DATA0_N (out), RXI_NO_DATA0_P (out), RXI_NO_DATA1_N (out), RXI_NO_DATA1_P (out), RXI_NO_DATA2_N (out), RXI_NO_DATA2_P (out), RXI_NO_DATA3_N (out), RXI_NO_DATA3_P (out), RXI_NO_DATA4_N (out), RXI_NO_DATA4_P (out), RXI_NO_DATA5_N (out), RXI_NO_DATA5_P (out), RXI_NO_DATA6_N (out), RXI_NO_DATA6_P (out), RXI_NO_DATA7_N (out), RXI_NO_DATA7_P (out), RXI_NO_FRAME_N (out), RXI_NO_FRAME_P (out), RXI_NO_LCLK_N (out), RXI_NO_LCLK_P (out), RXI_SO_DATA0_N (out), RXI_SO_DATA0_P (out), RXI_SO_DATA1_N (out), RXI_SO_DATA1_P (out), RXI_SO_DATA2_N (out), RXI_SO_DATA2_P (out), RXI_SO_DATA3_N (out), RXI_SO_DATA3_P (out), RXI_SO_DATA4_N (out), RXI_SO_DATA4_P (out), RXI_SO_DATA5_N (out), RXI_SO_DATA5_P (out), RXI_SO_DATA6_N (out), RXI_SO_DATA6_P (out), RXI_SO_DATA7_N (out), RXI_SO_DATA7_P (out), RXI_SO_FRAME_N (out), RXI_SO_FRAME_P (out), RXI_SO_LCLK_N (out), RXI_SO_LCLK_P (out), RXO_NO_RD_WAIT_N, RXO_NO_RD_WAIT_P, RXO_NO_WR_WAIT_N, RXO_NO_WR_WAIT_P, RXO_SO_RD_WAIT_N, RXO_SO_RD_WAIT_P, RXO_SO_WR_WAIT_N, RXO_SO_WR_WAIT_P, TXI_NO_RD_WAIT_N (out), TXI_NO_RD_WAIT_P (out), TXI_NO_WR_WAIT_N (out), TXI_NO_WR_WAIT_P (out), TXI_SO_RD_WAIT_N (out), TXI_SO_RD_WAIT_P (out), TXI_SO_WR_WAIT_N (out), TXI_SO_WR_WAIT_P (out), TXO_NO_DATA0_N, TXO_NO_DATA0_P, TXO_NO_DATA1_N, TXO_NO_DATA1_P, TXO_NO_DATA2_N, TXO_NO_DATA2_P, TXO_NO_DATA3_N, TXO_NO_DATA3_P, TXO_NO_DATA4_N, TXO_NO_DATA4_P, TXO_NO_DATA5_N, TXO_NO_DATA5_P, TXO_NO_DATA6_N, TXO_NO_DATA6_P, TXO_NO_DATA7_N, TXO_NO_DATA7_P, TXO_NO_FRAME_N, TXO_NO_FRAME_P, TXO_NO_LCLK_N, TXO_NO_LCLK_P, TXO_SO_DATA0_N, TXO_SO_DATA0_P, TXO_SO_DATA1_N, TXO_SO_DATA1_P, TXO_SO_DATA2_N, TXO_SO_DATA2_P, TXO_SO_DATA3_N, TXO_SO_DATA3_P, TXO_SO_DATA4_N, TXO_SO_DATA4_P, TXO_SO_DATA5_N, TXO_SO_DATA5_P, TXO_SO_DATA6_N, TXO_SO_DATA6_P, TXO_SO_DATA7_N, TXO_SO_DATA7_P, TXO_SO_FRAME_N, TXO_SO_FRAME_P, TXO_SO_LCLK_N, TXO_SO_LCLK_P

### Nets
1P8V: C270.1 C271.1 C272.1 C273.1 J8.1 J8.2 J9.1 J9.2
GND: C270.2 C271.2 C272.2 C273.2 J8.11 J8.12 J8.21 J8.22 J8.31 J8.32 J8.41 J8.42 J8.51 J8.52 J9.11 J9.12 J9.21 J9.22 J9.31 J9.32 J9.41 J9.42 J9.51 J9.52  [project net PHY_DIS_REG10]
NetJ8_3: J8.3 ; port RXI_NO_DATA0_N
NetJ8_4: J8.4 ; port RXI_NO_DATA1_N
NetJ8_5: J8.5 ; port RXI_NO_DATA0_P
NetJ8_6: J8.6 ; port RXI_NO_DATA1_P
NetJ8_7: J8.7 ; port RXI_NO_DATA2_N
NetJ8_8: J8.8 ; port RXI_NO_DATA3_N
NetJ8_9: J8.9 ; port RXI_NO_DATA2_P
NetJ8_10: J8.10 ; port RXI_NO_DATA3_P
NetJ8_13: J8.13 ; port RXI_NO_DATA4_N
NetJ8_14: J8.14 ; port RXI_NO_DATA5_N
NetJ8_15: J8.15 ; port RXI_NO_DATA4_P
NetJ8_16: J8.16 ; port RXI_NO_DATA5_P
NetJ8_17: J8.17 ; port RXI_NO_DATA6_N
NetJ8_18: J8.18 ; port RXI_NO_DATA7_N
NetJ8_19: J8.19 ; port RXI_NO_DATA6_P
NetJ8_20: J8.20 ; port RXI_NO_DATA7_P
NetJ8_23: J8.23 ; port RXI_NO_LCLK_N
NetJ8_24: J8.24 ; port RXI_NO_FRAME_N
NetJ8_25: J8.25 ; port RXI_NO_LCLK_P
NetJ8_26: J8.26 ; port RXI_NO_FRAME_P
NetJ8_27: J8.27 ; port RXO_NO_RD_WAIT_N
NetJ8_28: J8.28 ; port RXO_NO_WR_WAIT_N
NetJ8_29: J8.29 ; port RXO_NO_RD_WAIT_P
NetJ8_30: J8.30 ; port RXO_NO_WR_WAIT_P
NetJ8_33: J8.33 ; port TXO_NO_FRAME_N
NetJ8_34: J8.34 ; port TXI_NO_WR_WAIT_N
NetJ8_35: J8.35 ; port TXO_NO_FRAME_P
NetJ8_36: J8.36 ; port TXI_NO_WR_WAIT_P
NetJ8_37: J8.37 ; port TXO_NO_LCLK_N
NetJ8_38: J8.38 ; port TXI_NO_RD_WAIT_N
NetJ8_39: J8.39 ; port TXO_NO_LCLK_P
NetJ8_40: J8.40 ; port TXI_NO_RD_WAIT_P
NetJ8_43: J8.43 ; port TXO_NO_DATA0_N
NetJ8_44: J8.44 ; port TXO_NO_DATA1_N
NetJ8_45: J8.45 ; port TXO_NO_DATA0_P
NetJ8_46: J8.46 ; port TXO_NO_DATA1_P
NetJ8_47: J8.47 ; port TXO_NO_DATA2_N
NetJ8_48: J8.48 ; port TXO_NO_DATA3_N
NetJ8_49: J8.49 ; port TXO_NO_DATA2_P
NetJ8_50: J8.50 ; port TXO_NO_DATA3_P
NetJ8_53: J8.53 ; port TXO_NO_DATA4_N
NetJ8_54: J8.54 ; port TXO_NO_DATA5_N
NetJ8_55: J8.55 ; port TXO_NO_DATA4_P
NetJ8_56: J8.56 ; port TXO_NO_DATA5_P
NetJ8_57: J8.57 ; port TXO_NO_DATA6_N
NetJ8_58: J8.58 ; port TXO_NO_DATA7_N
NetJ8_59: J8.59 ; port TXO_NO_DATA6_P
NetJ8_60: J8.60 ; port TXO_NO_DATA7_P
NetJ9_3: J9.3 ; port RXI_SO_DATA0_N
NetJ9_4: J9.4 ; port RXI_SO_DATA1_N
NetJ9_5: J9.5 ; port RXI_SO_DATA0_P
NetJ9_6: J9.6 ; port RXI_SO_DATA1_P
NetJ9_7: J9.7 ; port RXI_SO_DATA2_N
NetJ9_8: J9.8 ; port RXI_SO_DATA3_N
NetJ9_9: J9.9 ; port RXI_SO_DATA2_P
NetJ9_10: J9.10 ; port RXI_SO_DATA3_P
NetJ9_13: J9.13 ; port RXI_SO_DATA4_N
NetJ9_14: J9.14 ; port RXI_SO_DATA5_N
NetJ9_15: J9.15 ; port RXI_SO_DATA4_P
NetJ9_16: J9.16 ; port RXI_SO_DATA5_P
NetJ9_17: J9.17 ; port RXI_SO_DATA6_N
NetJ9_18: J9.18 ; port RXI_SO_DATA7_N
NetJ9_19: J9.19 ; port RXI_SO_DATA6_P
NetJ9_20: J9.20 ; port RXI_SO_DATA7_P
NetJ9_23: J9.23 ; port RXI_SO_LCLK_N
NetJ9_24: J9.24 ; port RXI_SO_FRAME_N
NetJ9_25: J9.25 ; port RXI_SO_LCLK_P
NetJ9_26: J9.26 ; port RXI_SO_FRAME_P
NetJ9_27: J9.27 ; port RXO_SO_RD_WAIT_N
NetJ9_28: J9.28 ; port RXO_SO_WR_WAIT_N
NetJ9_29: J9.29 ; port RXO_SO_RD_WAIT_P
NetJ9_30: J9.30 ; port RXO_SO_WR_WAIT_P
NetJ9_33: J9.33 ; port TXO_SO_FRAME_N
NetJ9_34: J9.34 ; port TXI_SO_WR_WAIT_N
NetJ9_35: J9.35 ; port TXO_SO_FRAME_P
NetJ9_36: J9.36 ; port TXI_SO_WR_WAIT_P
NetJ9_37: J9.37 ; port TXO_SO_LCLK_N
NetJ9_38: J9.38 ; port TXI_SO_RD_WAIT_N
NetJ9_39: J9.39 ; port TXO_SO_LCLK_P
NetJ9_40: J9.40 ; port TXI_SO_RD_WAIT_P
NetJ9_43: J9.43 ; port TXO_SO_DATA0_N
NetJ9_44: J9.44 ; port TXO_SO_DATA1_N
NetJ9_45: J9.45 ; port TXO_SO_DATA0_P
NetJ9_46: J9.46 ; port TXO_SO_DATA1_P
NetJ9_47: J9.47 ; port TXO_SO_DATA2_N
NetJ9_48: J9.48 ; port TXO_SO_DATA3_N
NetJ9_49: J9.49 ; port TXO_SO_DATA2_P
NetJ9_50: J9.50 ; port TXO_SO_DATA3_P
NetJ9_53: J9.53 ; port TXO_SO_DATA4_N
NetJ9_54: J9.54 ; port TXO_SO_DATA5_N
NetJ9_55: J9.55 ; port TXO_SO_DATA4_P
NetJ9_56: J9.56 ; port TXO_SO_DATA5_P
NetJ9_57: J9.57 ; port TXO_SO_DATA6_N
NetJ9_58: J9.58 ; port TXO_SO_DATA7_N
NetJ9_59: J9.59 ; port TXO_SO_DATA6_P
NetJ9_60: J9.60 ; port TXO_SO_DATA7_P

### Notes on the sheet
- DSP eLINK CONNECTORS
- eLINK North Connector
- eLINK South Connector
- (in symbol TitleBlock0) Title; Size; Document Number; Rev; Date:; Sheet; of

### Library data of the parts
C270-C273 = CAP0402_0P47UF_X5R: as C154-C160 on sheet 10-ZYNQ PWR & GND; DEVICE: CAP0402_0P47UF_X5R; Vendor: TDK; Vendor PN: C1005X5R1C474K; PCB Footprint: C0402
J8 J9 = CON_BSH_030_VERT: Vendor: SAMTEC; Vendor PN: BSH-030-01-F-D-A; DEVICE: CON_BSH_030_VERT; PCB Footprint: CONN_BSH60P_13P59X25P88_P5P_V; Supplier 1: Arrow; Supplier Part Number 1: BSH-030-01-F-D-A
*#14 = TitleBlock0: Page Create Date: March  8, 1995; Page Modify Date: *